# EAGLE design cpuboard (EAGLE 5.10)

## Sheet 1 of 9
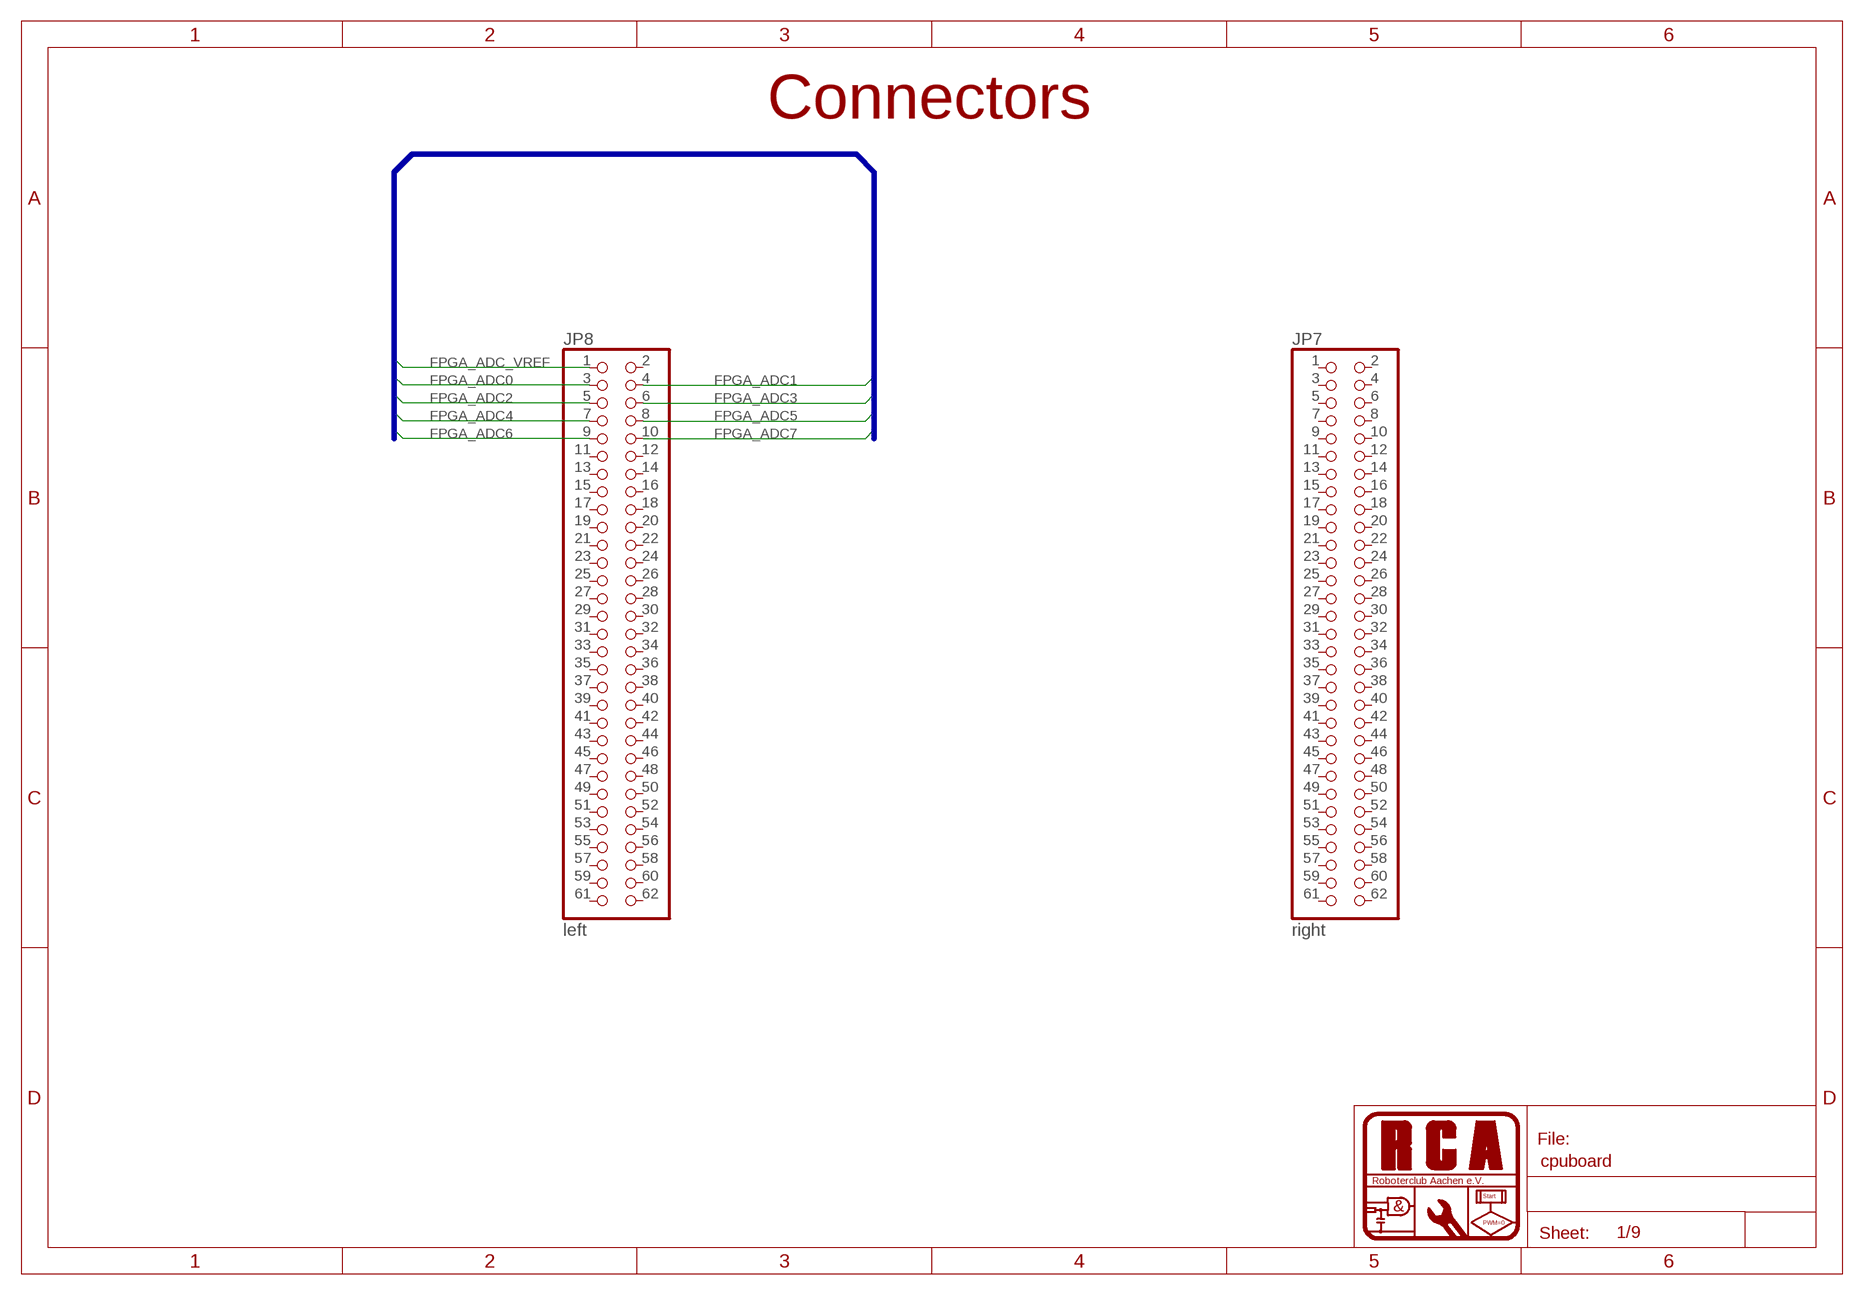
[diagram p0: schematic, sheet 1]

### Parts
JP7  right  PINHD-2X32_2.00-SMD  [2X32M_SMD]
JP8  left  PINHD-2X32_2.00-SMD  [2X32M_SMD]

### Nets
FPGA_ADC0: JP8.3 ; also sheet 4
FPGA_ADC1: JP8.4 ; also sheet 4
FPGA_ADC2: JP8.5 ; also sheet 4
FPGA_ADC3: JP8.6 ; also sheet 4
FPGA_ADC4: JP8.7 ; also sheet 4
FPGA_ADC5: JP8.8 ; also sheet 4
FPGA_ADC6: JP8.9 ; also sheet 4
FPGA_ADC7: JP8.10 ; also sheet 4
FPGA_ADC_VREF: JP8.1 ; also sheet 4
Unconnected: JP7.1 JP7.2 JP7.3 JP7.4 JP7.5 JP7.6 JP7.7 JP7.8 JP7.9 JP7.10 JP7.11 JP7.12 JP7.13 JP7.14 JP7.15 JP7.16 JP7.17 JP7.18 JP7.19 JP7.20 JP7.21 JP7.22 JP7.23 JP7.24 JP7.25 JP7.26 JP7.27 JP7.28 JP7.29 JP7.30 JP7.31 JP7.32 JP7.33 JP7.34 JP7.35 JP7.36 JP7.37 JP7.38 JP7.39 JP7.40 JP7.41 JP7.42 JP7.43 JP7.44 JP7.45 JP7.46 JP7.47 JP7.48 JP7.49 JP7.50 JP7.51 JP7.52 JP7.53 JP7.54 JP7.55 JP7.56 JP7.57 JP7.58 JP7.59 JP7.60 JP7.61 JP7.62 JP8.2 JP8.11 JP8.12 JP8.13 JP8.14 JP8.15 JP8.16 JP8.17 JP8.18 JP8.19 JP8.20 JP8.21 JP8.22 JP8.23 JP8.24 JP8.25 JP8.26 JP8.27 JP8.28 JP8.29 JP8.30 JP8.31 JP8.32 JP8.33 JP8.34 JP8.35 JP8.36 JP8.37 JP8.38 JP8.39 JP8.40 JP8.41 JP8.42 JP8.43 JP8.44 JP8.45 JP8.46 JP8.47 JP8.48 JP8.49 JP8.50 JP8.51 JP8.52 JP8.53 JP8.54 JP8.55 JP8.56 JP8.57 JP8.58 JP8.59 JP8.60 JP8.61 JP8.62

### Buses
FPGA_ADC[0..7],FPGA_ADC_VREF

### Notes on the sheet
- Connectors

## Sheet 2 of 9
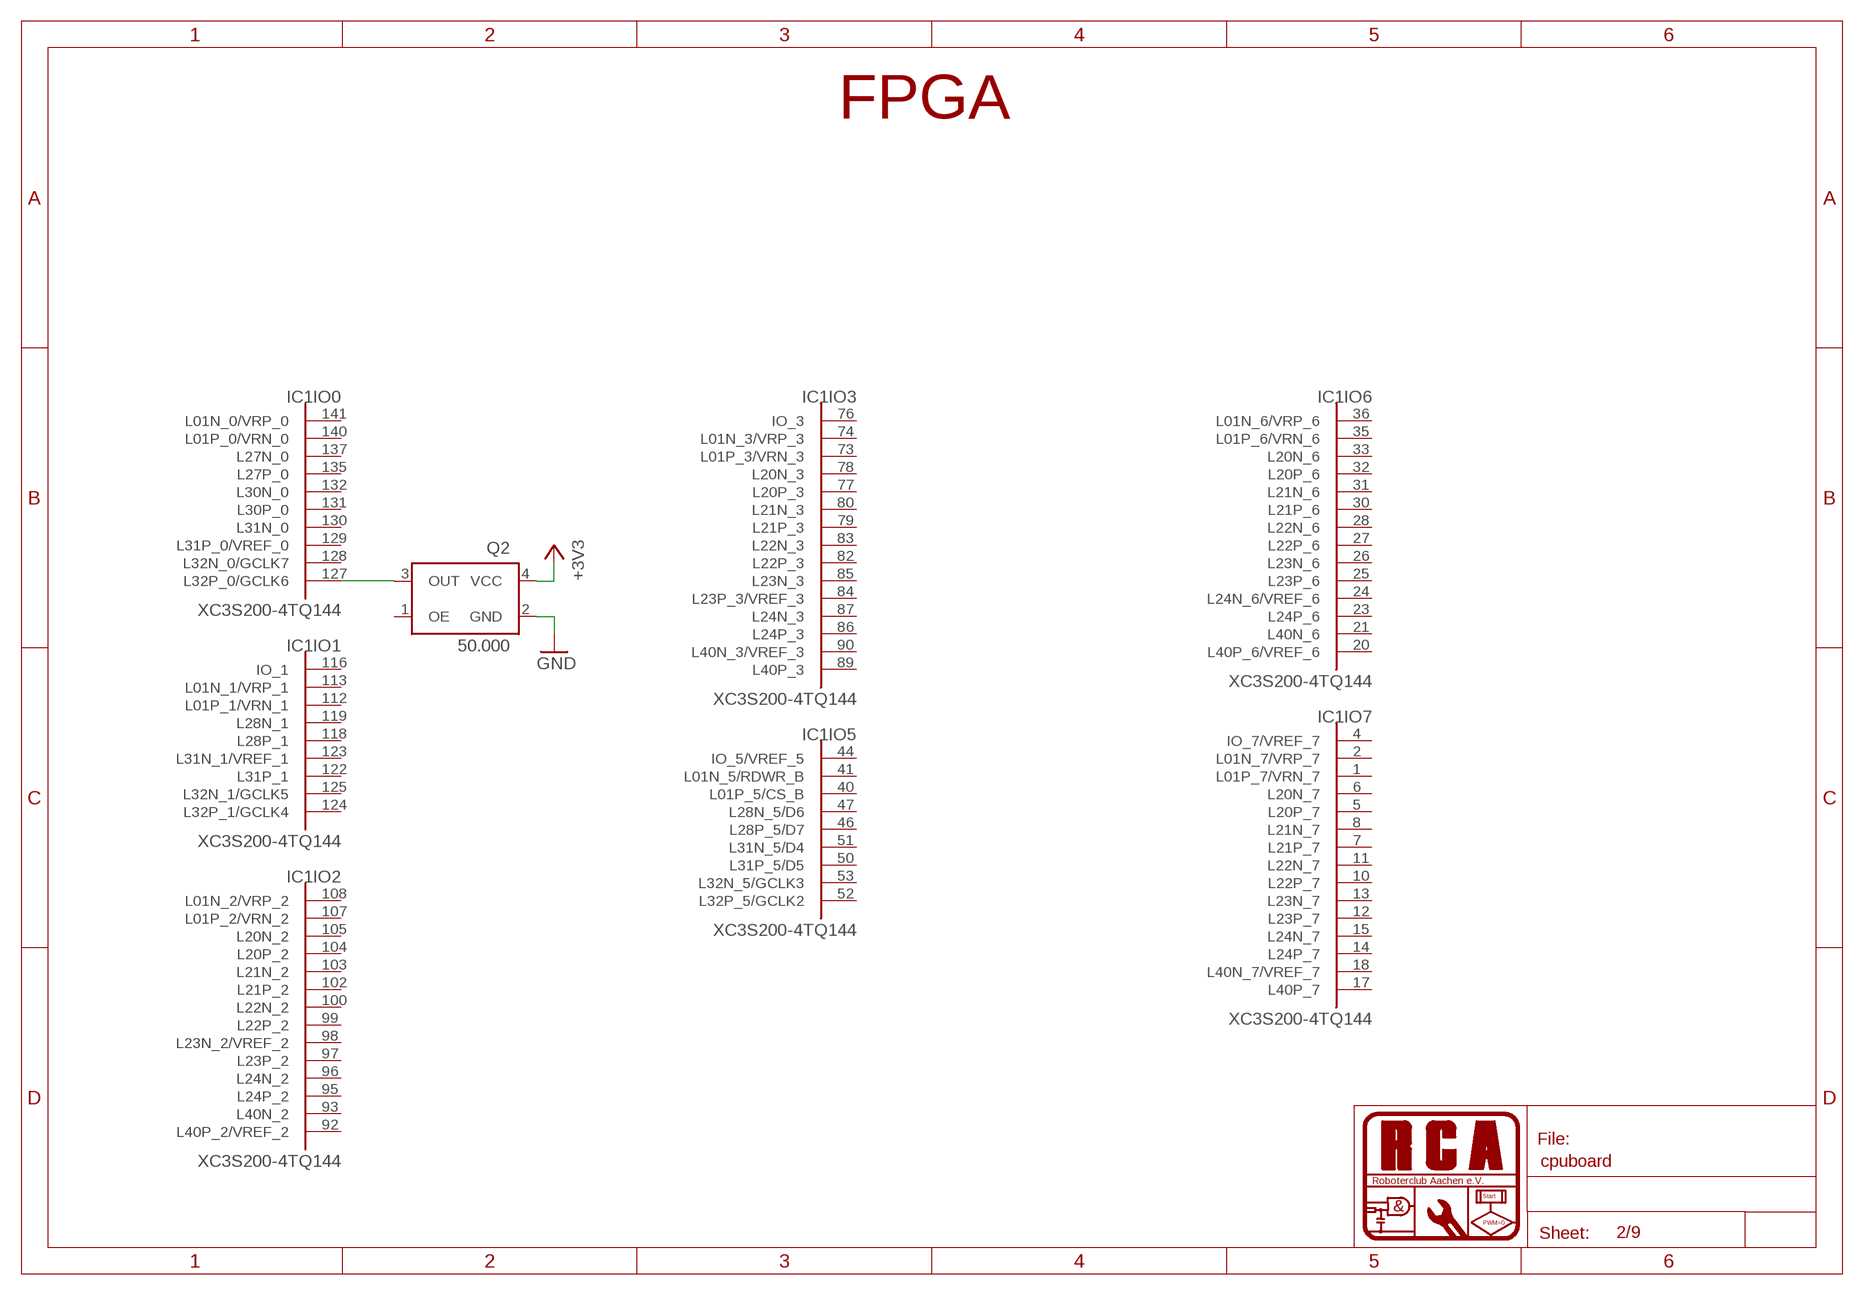
[diagram p1: schematic, sheet 2]

### Parts
IC1  XC3S200-4TQ144  [TQ144]
Q2  50.000  XO53  [XO53]

### Nets
+3V3: Q2.4(VCC) ; also sheet 4,5,6,7,8,9
GND: Q2.2(GND) ; also sheet 3,4,5,6,7,8,9
N$32: IC1.127(IO0:L32P_0/GCLK6) Q2.3(OUT)
Unconnected: IC1.1(IO7:L01P_7/VRN_7) IC1.2(IO7:L01N_7/VRP_7) IC1.4(IO7:IO_7/VREF_7) IC1.5(IO7:L20P_7) IC1.6(IO7:L20N_7) IC1.7(IO7:L21P_7) IC1.8(IO7:L21N_7) IC1.10(IO7:L22P_7) IC1.11(IO7:L22N_7) IC1.12(IO7:L23P_7) IC1.13(IO7:L23N_7) IC1.14(IO7:L24P_7) IC1.15(IO7:L24N_7) IC1.17(IO7:L40P_7) IC1.18(IO7:L40N_7/VREF_7) IC1.20(IO6:L40P_6/VREF_6) IC1.21(IO6:L40N_6) IC1.23(IO6:L24P_6) IC1.24(IO6:L24N_6/VREF_6) IC1.25(IO6:L23P_6) IC1.26(IO6:L23N_6) IC1.27(IO6:L22P_6) IC1.28(IO6:L22N_6) IC1.30(IO6:L21P_6) IC1.31(IO6:L21N_6) IC1.32(IO6:L20P_6) IC1.33(IO6:L20N_6) IC1.35(IO6:L01P_6/VRN_6) IC1.36(IO6:L01N_6/VRP_6) IC1.40(IO5:L01P_5/CS_B) IC1.41(IO5:L01N_5/RDWR_B) IC1.44(IO5:IO_5/VREF_5) IC1.46(IO5:L28P_5/D7) IC1.47(IO5:L28N_5/D6) IC1.50(IO5:L31P_5/D5) IC1.51(IO5:L31N_5/D4) IC1.52(IO5:L32P_5/GCLK2) IC1.53(IO5:L32N_5/GCLK3) IC1.73(IO3:L01P_3/VRN_3) IC1.74(IO3:L01N_3/VRP_3) IC1.76(IO3:IO_3) IC1.77(IO3:L20P_3) IC1.78(IO3:L20N_3) IC1.79(IO3:L21P_3) IC1.80(IO3:L21N_3) IC1.82(IO3:L22P_3) IC1.83(IO3:L22N_3) IC1.84(IO3:L23P_3/VREF_3) IC1.85(IO3:L23N_3) IC1.86(IO3:L24P_3) IC1.87(IO3:L24N_3) IC1.89(IO3:L40P_3) IC1.90(IO3:L40N_3/VREF_3) IC1.92(IO2:L40P_2/VREF_2) IC1.93(IO2:L40N_2) IC1.95(IO2:L24P_2) IC1.96(IO2:L24N_2) IC1.97(IO2:L23P_2) IC1.98(IO2:L23N_2/VREF_2) IC1.99(IO2:L22P_2) IC1.100(IO2:L22N_2) IC1.102(IO2:L21P_2) IC1.103(IO2:L21N_2) IC1.104(IO2:L20P_2) IC1.105(IO2:L20N_2) IC1.107(IO2:L01P_2/VRN_2) IC1.108(IO2:L01N_2/VRP_2) IC1.112(IO1:L01P_1/VRN_1) IC1.113(IO1:L01N_1/VRP_1) IC1.116(IO1:IO_1) IC1.118(IO1:L28P_1) IC1.119(IO1:L28N_1) IC1.122(IO1:L31P_1) IC1.123(IO1:L31N_1/VREF_1) IC1.124(IO1:L32P_1/GCLK4) IC1.125(IO1:L32N_1/GCLK5) IC1.128(IO0:L32N_0/GCLK7) IC1.129(IO0:L31P_0/VREF_0) IC1.130(IO0:L31N_0) IC1.131(IO0:L30P_0) IC1.132(IO0:L30N_0) IC1.135(IO0:L27P_0) IC1.137(IO0:L27N_0) IC1.140(IO0:L01P_0/VRN_0) IC1.141(IO0:L01N_0/VRP_0) Q2.1(OE)

### Notes on the sheet
- FPGA

## Sheet 3 of 9
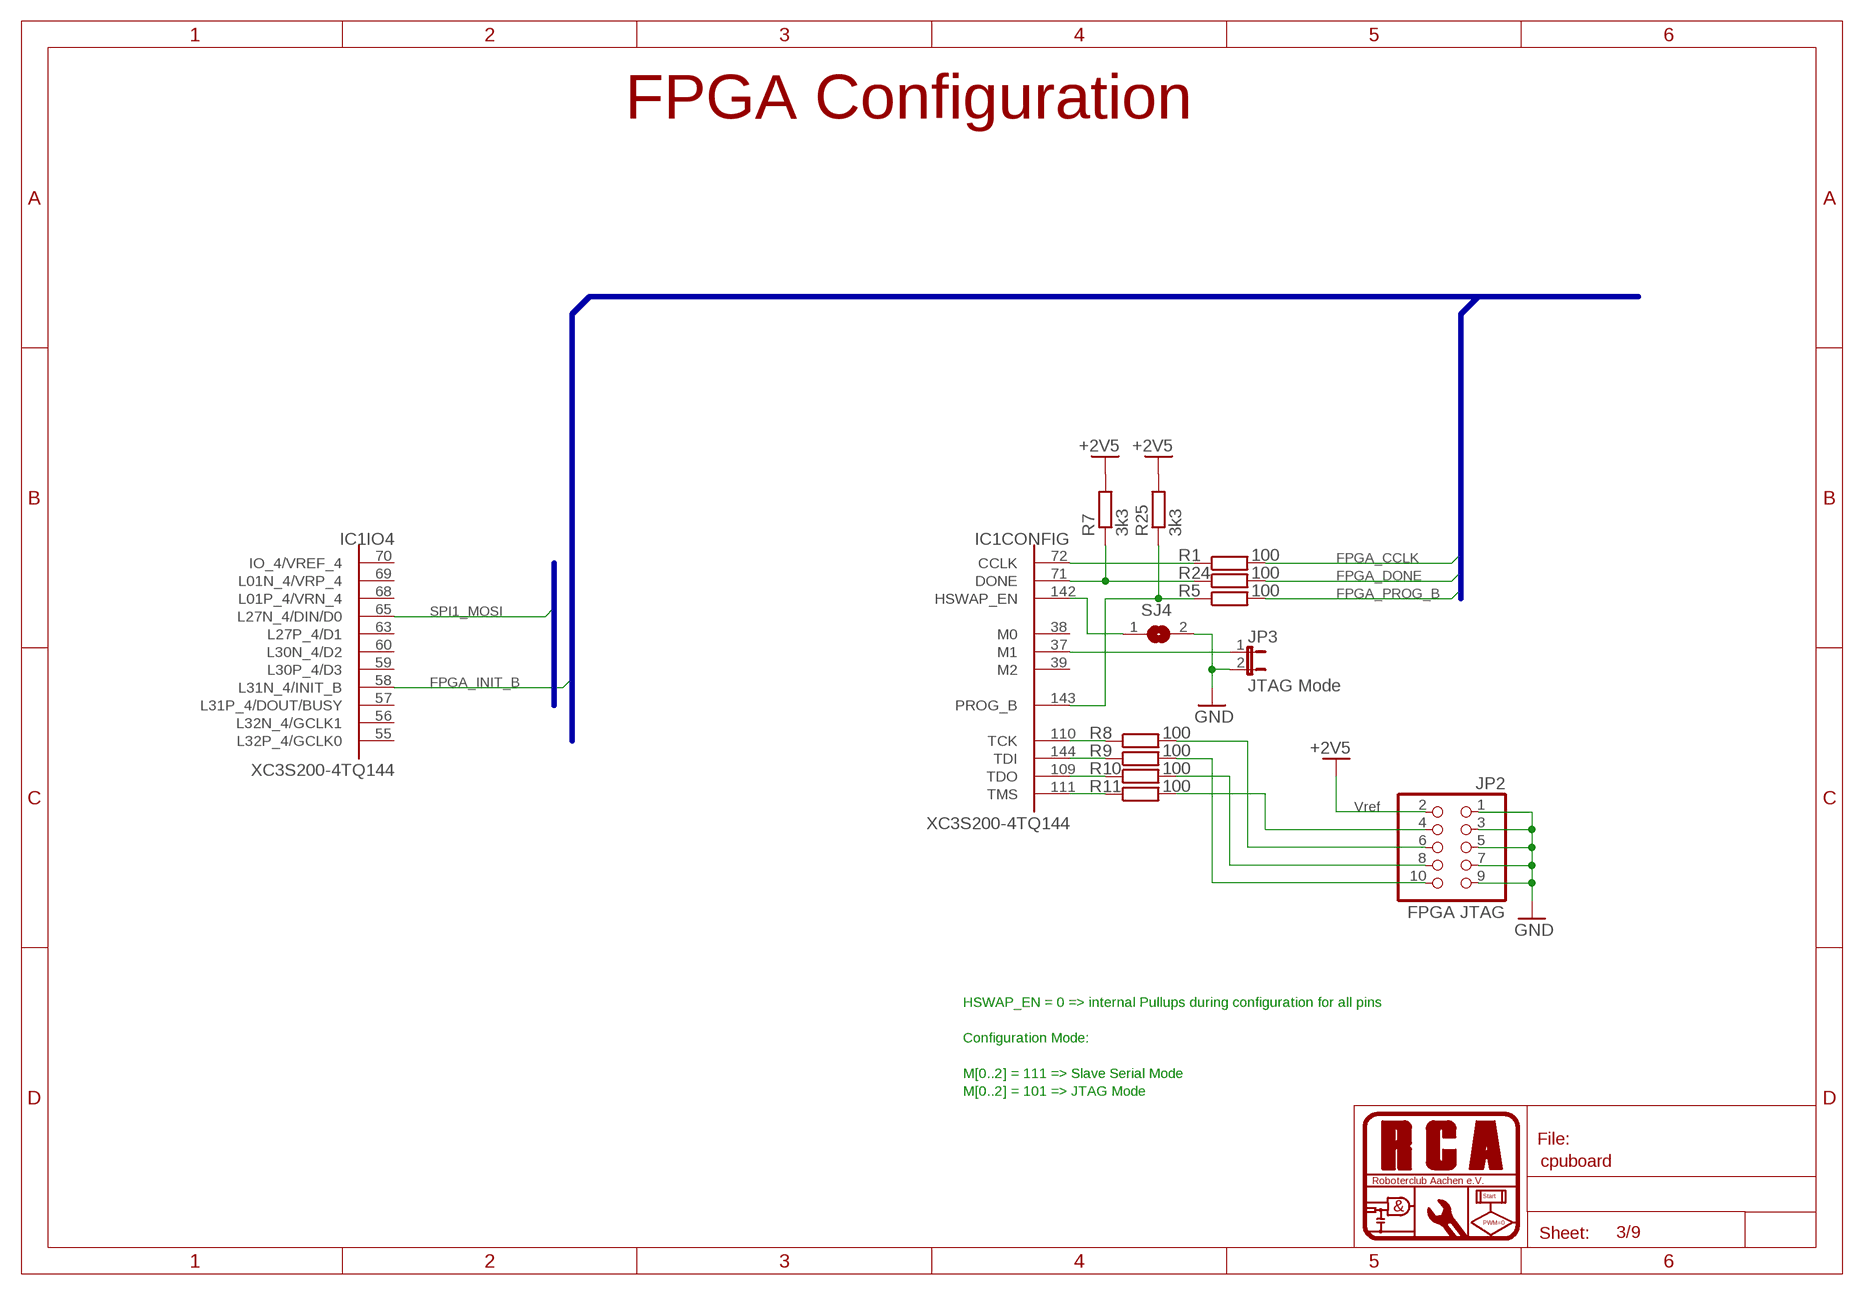
[diagram p2: schematic, sheet 3]

### Parts
JP2  FPGA JTAG  PINHD-2X5_2.54-SMD  [2X05SMD]
JP3  JTAG Mode  JP1E  [JP1]
R1  100  R-EU_R0805  [R0805]
R5  100  R-EU_R0805  [R0805]
R7  3k3  R-EU_R0805  [R0805]
R8  100  R-EU_R0805  [R0805]
R9  100  R-EU_R0805  [R0805]
R10  100  R-EU_R0805  [R0805]
R11  100  R-EU_R0805  [R0805]
R24  100  R-EU_R0805  [R0805]
R25  3k3  R-EU_R0805  [R0805]
SJ4  SJ  [SJ]

### Nets
+2V5: JP2.2 R7.2 R25.2 ; also sheet 5,9
FPGA_CCLK: R1.2
FPGA_DONE: R24.2
FPGA_INIT_B: IC1.58(IO4:L31N_4/INIT_B)
FPGA_PROG_B: R5.2
GND: JP2.1 JP2.3 JP2.5 JP2.7 JP2.9 JP3.2 SJ4.2 ; also sheet 2,4,5,6,7,8,9
N$2: IC1.143(CONFIG:PROG_B) R5.1 R25.1
N$3: IC1.71(CONFIG:DONE) R7.1 R24.1
N$5: IC1.37(CONFIG:M1) JP3.1
N$6: IC1.142(CONFIG:HSWAP_EN) SJ4.1
N$7: IC1.72(CONFIG:CCLK) R1.1
N$8: IC1.110(CONFIG:TCK) R8.1
N$9: IC1.144(CONFIG:TDI) R9.1
N$10: IC1.109(CONFIG:TDO) R10.1
N$11: IC1.111(CONFIG:TMS) R11.1
N$12: JP2.6 R8.2
N$13: JP2.8 R10.2
N$14: JP2.10 R9.2
N$15: JP2.4 R11.2
SPI1_MOSI: IC1.65(IO4:L27N_4/DIN/D0) ; also sheet 6
Unconnected: IC1.38(CONFIG:M0) IC1.39(CONFIG:M2) IC1.55(IO4:L32P_4/GCLK0) IC1.56(IO4:L32N_4/GCLK1) IC1.57(IO4:L31P_4/DOUT/BUSY) IC1.59(IO4:L30P_4/D3) IC1.60(IO4:L30N_4/D2) IC1.63(IO4:L27P_4/D1) IC1.68(IO4:L01P_4/VRN_4) IC1.69(IO4:L01N_4/VRP_4) IC1.70(IO4:IO_4/VREF_4)

### Buses
SPI1_NSS,SPI1_SCK,SPI1_MISO,SPI1_MOSI
FPGA_CCLK,FPGA_INIT_B,FPGA_DONE,FPGA_PROG_B

### Notes on the sheet
- FPGA Configuration
- Vref
- HSWAP_EN = 0 => internal Pullups during configuration for all pins
- Configuration Mode:
- M[0..2] = 111 => Slave Serial Mode
- M[0..2] = 101 => JTAG Mode

## Sheet 4 of 9
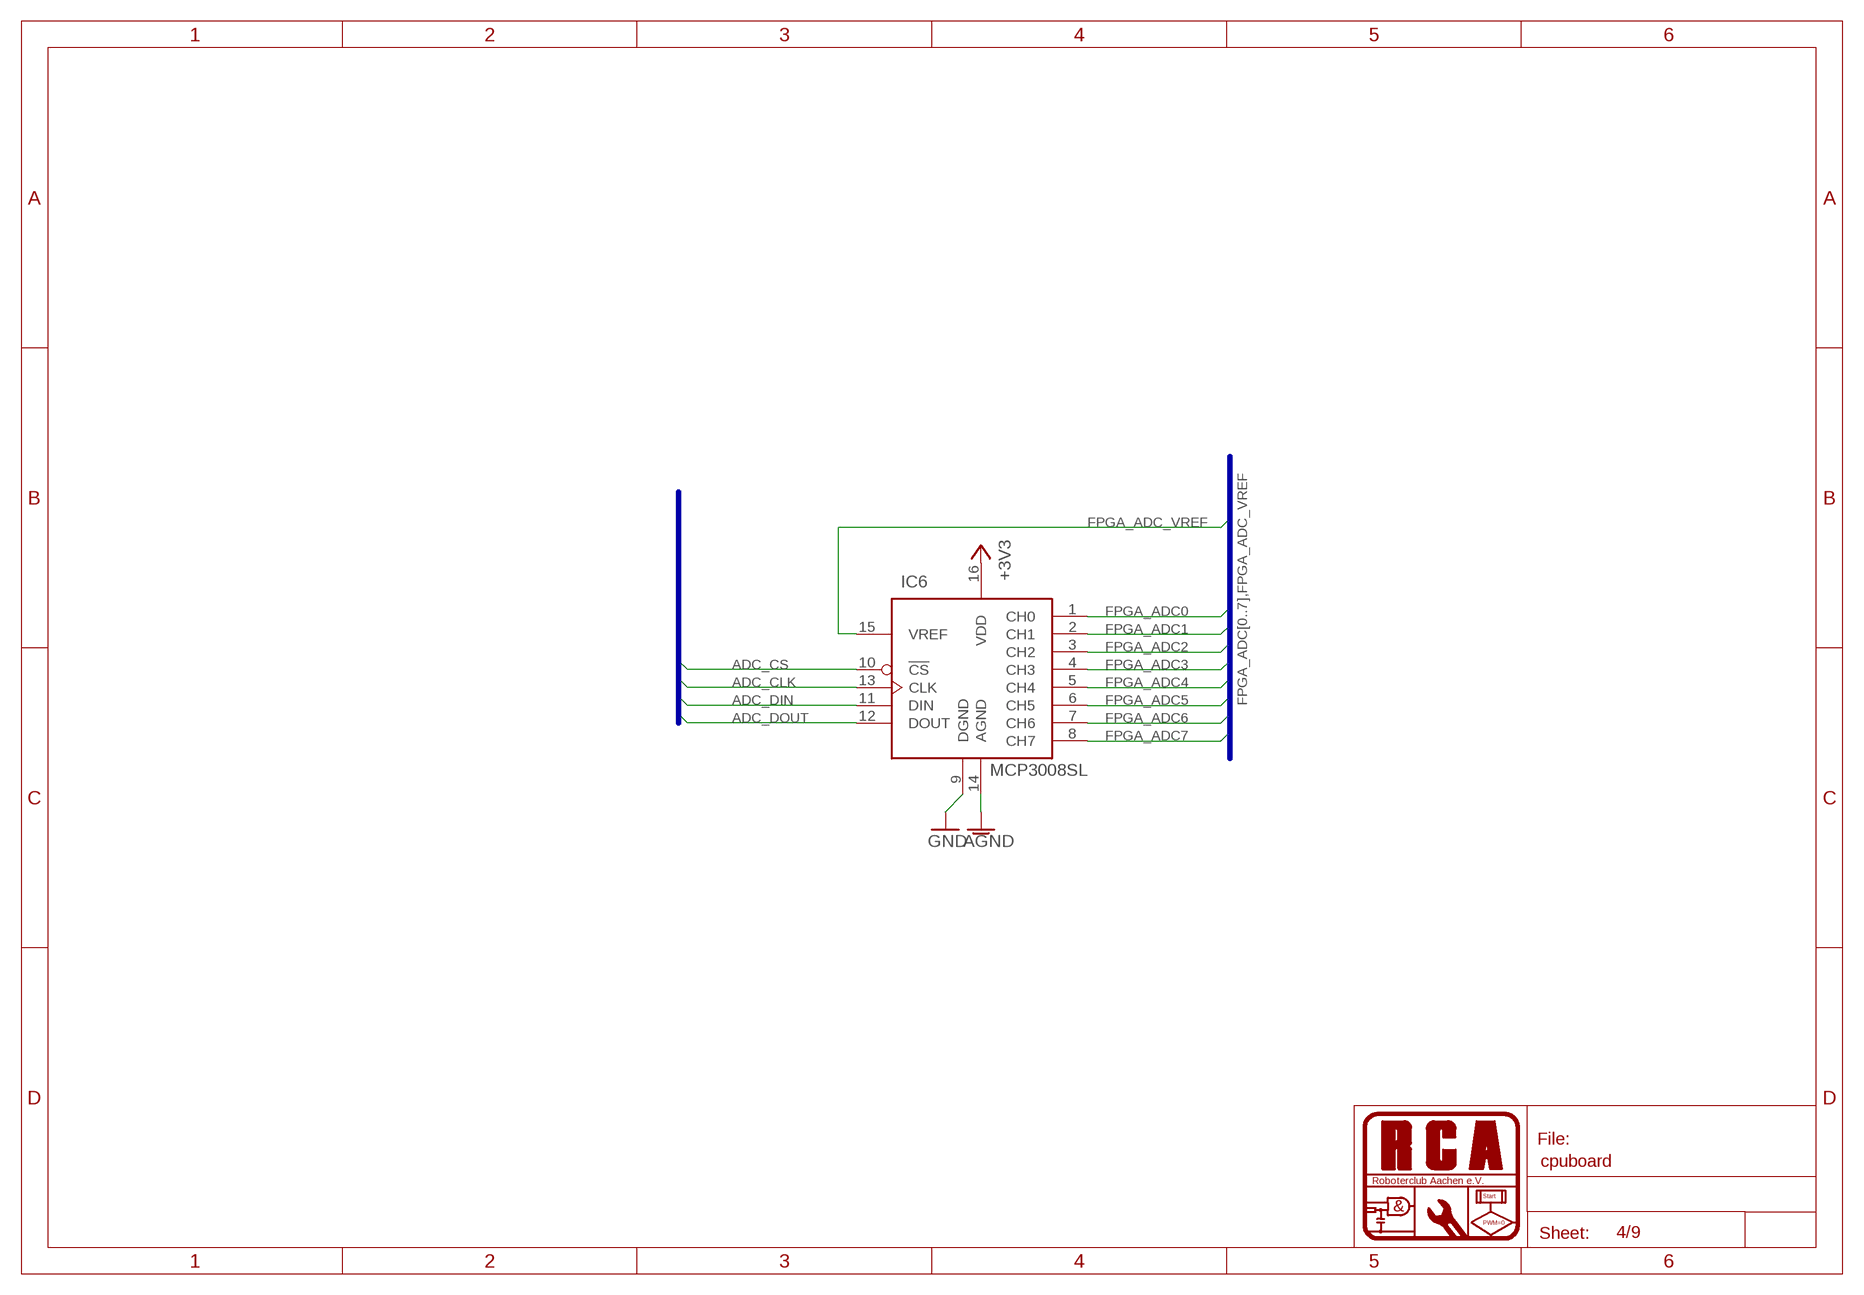
[diagram p3: schematic, sheet 4]

### Parts
IC6  MCP3008SL  [SO16]

### Nets
+3V3: IC6.16(VDD) ; also sheet 2,5,6,7,8,9
ADC_CLK: IC6.13(CLK)
ADC_CS: IC6.10(!CS)
ADC_DIN: IC6.11(DIN)
ADC_DOUT: IC6.12(DOUT)
AGND: IC6.14(AGND)
FPGA_ADC0: IC6.1(CH0) ; also sheet 1
FPGA_ADC1: IC6.2(CH1) ; also sheet 1
FPGA_ADC2: IC6.3(CH2) ; also sheet 1
FPGA_ADC3: IC6.4(CH3) ; also sheet 1
FPGA_ADC4: IC6.5(CH4) ; also sheet 1
FPGA_ADC5: IC6.6(CH5) ; also sheet 1
FPGA_ADC6: IC6.7(CH6) ; also sheet 1
FPGA_ADC7: IC6.8(CH7) ; also sheet 1
FPGA_ADC_VREF: IC6.15(VREF) ; also sheet 1
GND: IC6.9(DGND) ; also sheet 2,3,5,6,7,8,9

### Buses
FPGA_ADC[0..7],FPGA_ADC_VREF
ADC_CS,ADC_CLK,ADC_DIN,ADC_DOUT

## Sheet 5 of 9
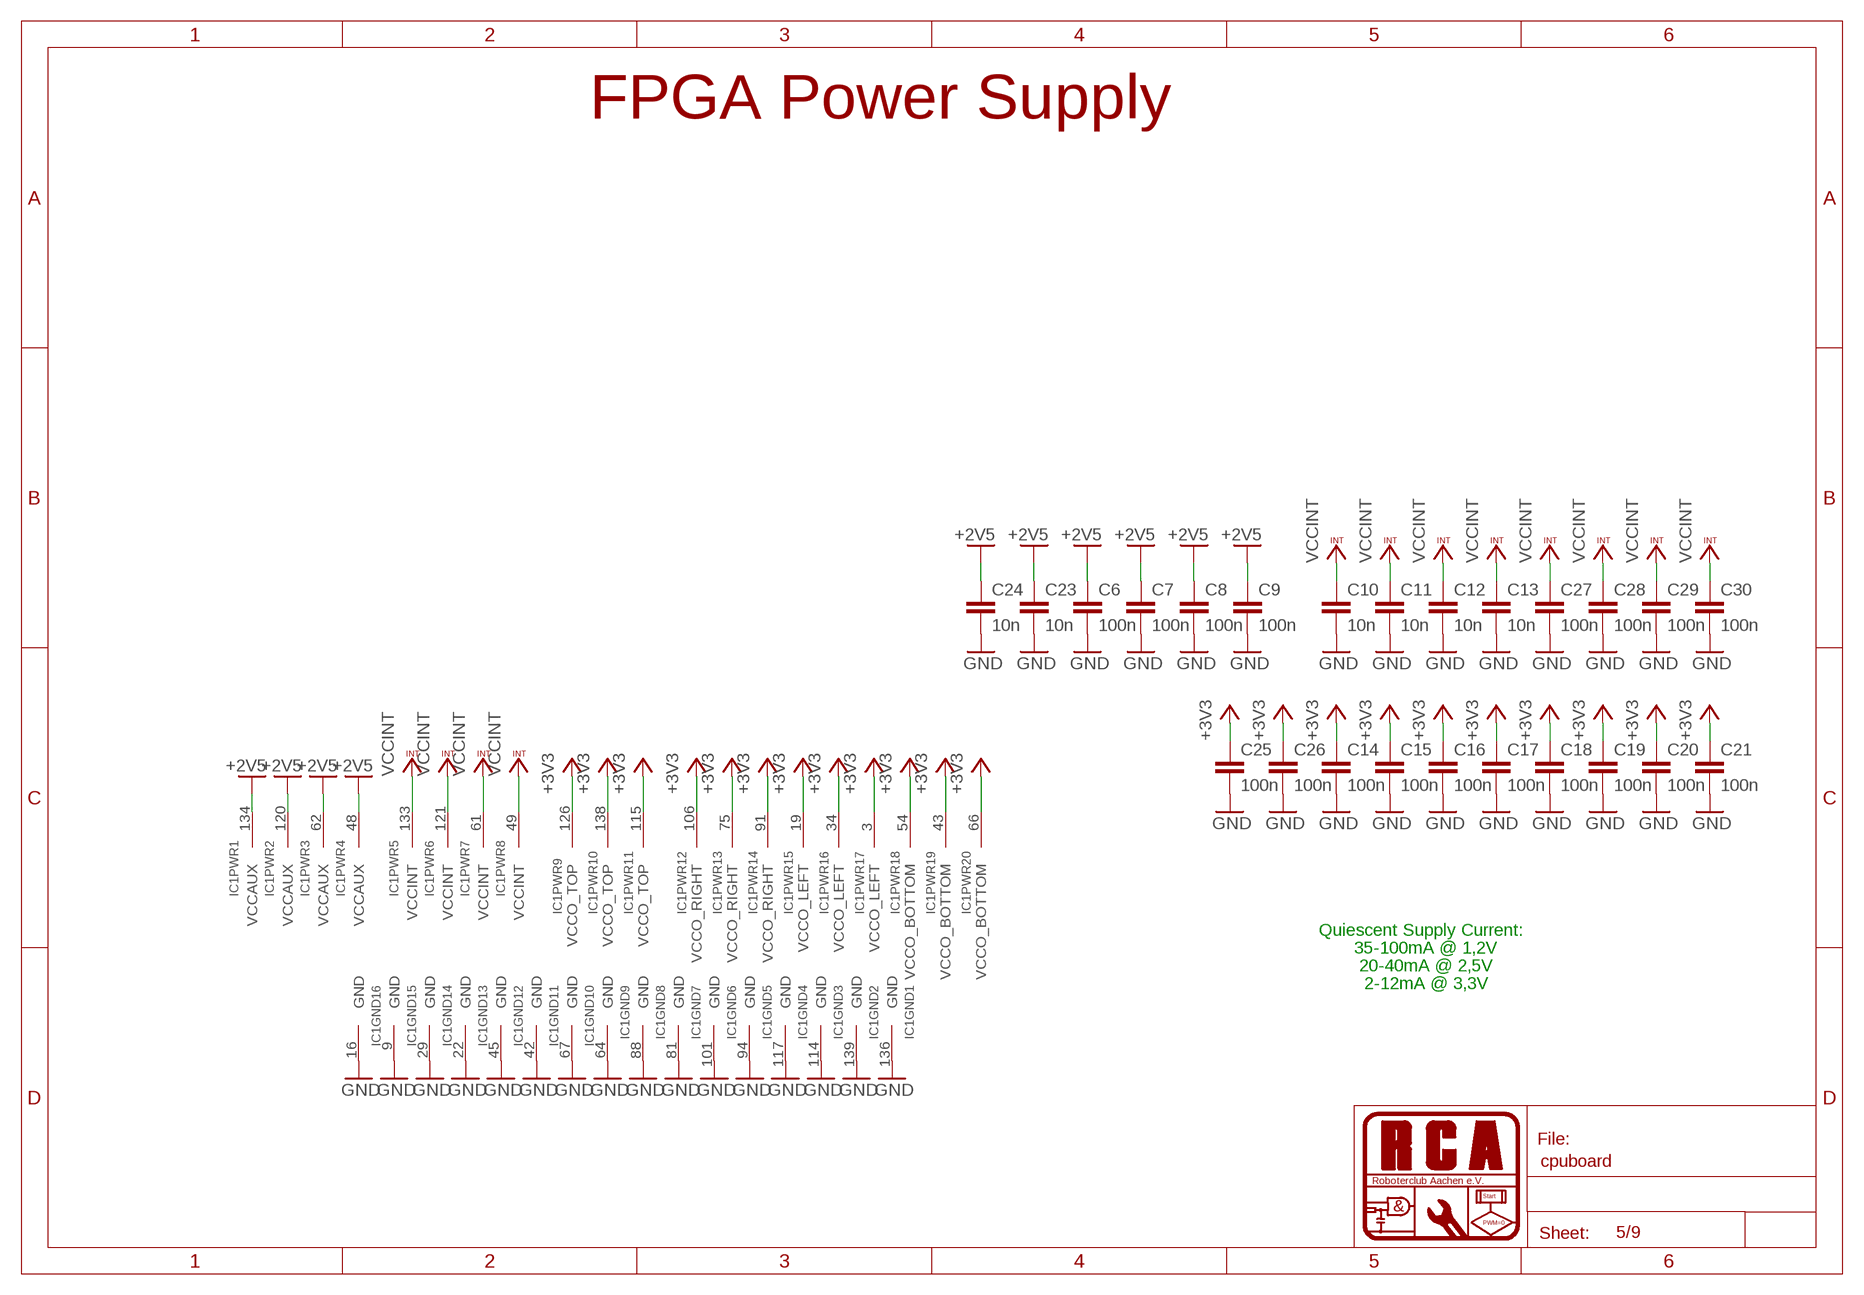
[diagram p4: schematic, sheet 5]

### Parts
C6  100n  C-EUC0603  [C0603]
C7  100n  C-EUC0603  [C0603]
C8  100n  C-EUC0603  [C0603]
C9  100n  C-EUC0603  [C0603]
C10  10n  C-EUC0603  [C0603]
C11  10n  C-EUC0603  [C0603]
C12  10n  C-EUC0603  [C0603]
C13  10n  C-EUC0603  [C0603]
C14  100n  C-EUC0603  [C0603]
C15  100n  C-EUC0603  [C0603]
C16  100n  C-EUC0603  [C0603]
C17  100n  C-EUC0603  [C0603]
C18  100n  C-EUC0603  [C0603]
C19  100n  C-EUC0603  [C0603]
C20  100n  C-EUC0603  [C0603]
C21  100n  C-EUC0603  [C0603]
C23  10n  C-EUC0603  [C0603]
C24  10n  C-EUC0603  [C0603]
C25  100n  C-EUC0603  [C0603]
C26  100n  C-EUC0603  [C0603]
C27  100n  C-EUC0603  [C0603]
C28  100n  C-EUC0603  [C0603]
C29  100n  C-EUC0603  [C0603]
C30  100n  C-EUC0603  [C0603]

### Nets
+2V5: C6.1 C7.1 C8.1 C9.1 C23.1 C24.1 IC1.48(PWR4:VCCAUX) IC1.62(PWR3:VCCAUX) IC1.120(PWR2:VCCAUX) IC1.134(PWR1:VCCAUX) ; also sheet 3,9
+3V3: C14.1 C15.1 C16.1 C17.1 C18.1 C19.1 C20.1 C21.1 C25.1 C26.1 IC1.3(PWR17:VCCO_LEFT) IC1.19(PWR15:VCCO_LEFT) IC1.34(PWR16:VCCO_LEFT) IC1.43(PWR19:VCCO_BOTTOM) IC1.54(PWR18:VCCO_BOTTOM) IC1.66(PWR20:VCCO_BOTTOM) IC1.75(PWR13:VCCO_RIGHT) IC1.91(PWR14:VCCO_RIGHT) IC1.106(PWR12:VCCO_RIGHT) IC1.115(PWR11:VCCO_TOP) IC1.126(PWR9:VCCO_TOP) IC1.138(PWR10:VCCO_TOP) ; also sheet 2,4,6,7,8,9
GND: C6.2 C7.2 C8.2 C9.2 C10.2 C11.2 C12.2 C13.2 C14.2 C15.2 C16.2 C17.2 C18.2 C19.2 C20.2 C21.2 C23.2 C24.2 C25.2 C26.2 C27.2 C28.2 C29.2 C30.2 IC1.9(GND15:GND) IC1.16(GND16:GND) IC1.22(GND13:GND) IC1.29(GND14:GND) IC1.42(GND11:GND) IC1.45(GND12:GND) IC1.64(GND9:GND) IC1.67(GND10:GND) IC1.81(GND7:GND) IC1.88(GND8:GND) IC1.94(GND5:GND) IC1.101(GND6:GND) IC1.114(GND3:GND) IC1.117(GND4:GND) IC1.136(GND1:GND) IC1.139(GND2:GND) ; also sheet 2,3,4,6,7,8,9
VCCINT: C10.1 C11.1 C12.1 C13.1 C27.1 C28.1 C29.1 C30.1 IC1.49(PWR8:VCCINT) IC1.61(PWR7:VCCINT) IC1.121(PWR6:VCCINT) IC1.133(PWR5:VCCINT) ; also sheet 9

### Notes on the sheet
- FPGA Power Supply
- Quiescent Supply Current:
- 35-100mA @ 1,2V
- 20-40mA @ 2,5V
- 2-12mA @ 3,3V

## Sheet 6 of 9
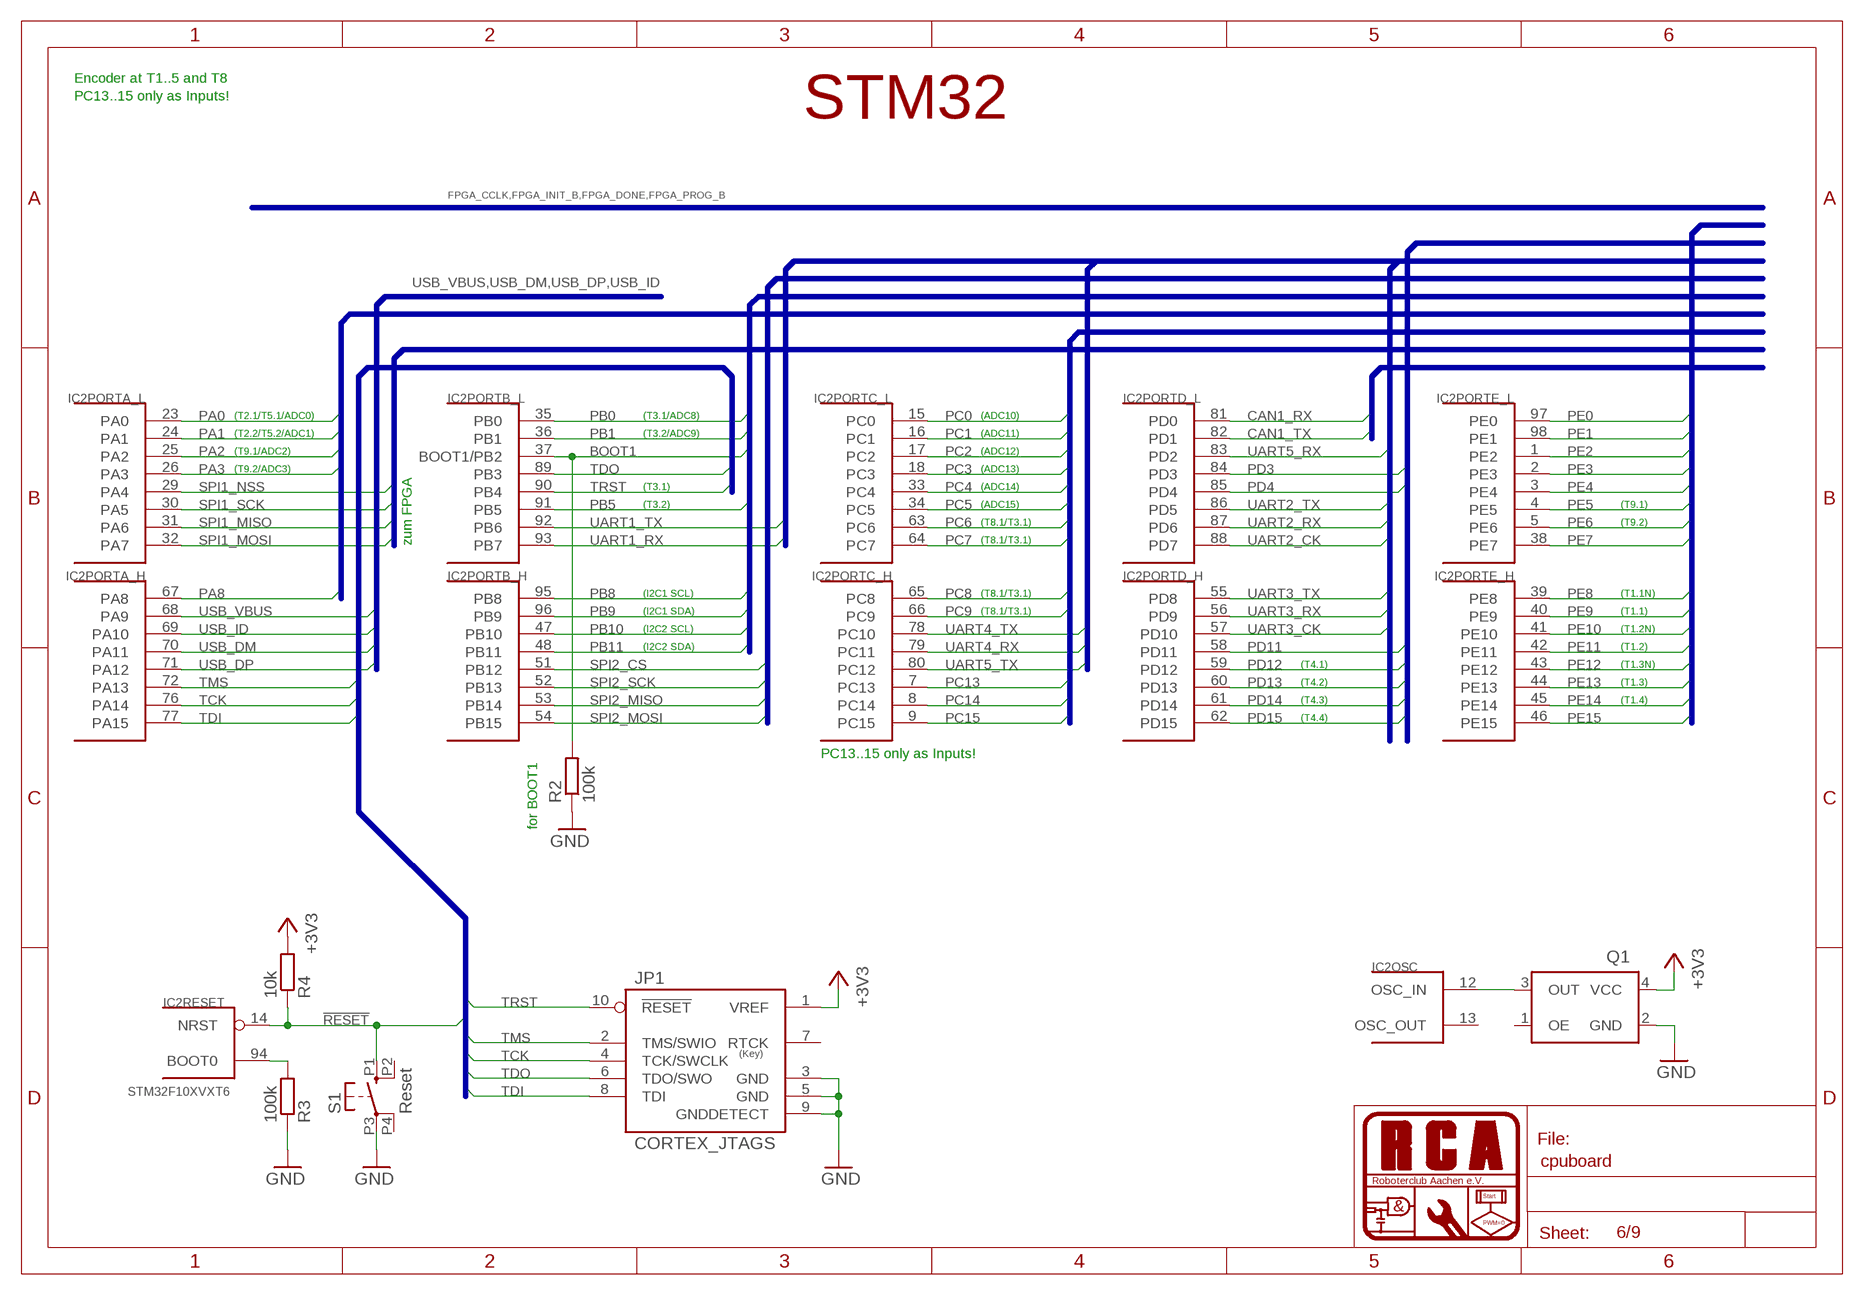
[diagram p5: schematic, sheet 6]

### Parts
IC2  STM32F10XVXT6  [TQFP100]
JP1  CORTEX_JTAGS  [2X05SMD]
Q1  XO53  [XO53]
R2  100k  R-EU_R0805  [R0805]
R3  100k  R-EU_R0805  [R0805]
R4  10k  R-EU_R0805  [R0805]
S1  Reset  10-XXLSH  [B3F-10XX-SMD]

### Nets
!RESET: IC2.14(RESET:NRST) R4.1 S1.P1(S)
+3V3: JP1.1(VREF) Q1.4(VCC) R4.2 ; also sheet 2,4,5,7,8,9
BOOT1: IC2.37(PORTB_L:BOOT1/PB2) R2.2
CAN1_RX: IC2.81(PORTD_L:PD0) ; also sheet 7
CAN1_TX: IC2.82(PORTD_L:PD1) ; also sheet 7
GND: JP1.3(GND) JP1.5(GND) JP1.9(GNDDETECT) Q1.2(GND) R2.1 R3.1 S1.P3(P) ; also sheet 2,3,4,5,7,8,9
N$1: IC2.12(OSC:OSC_IN) Q1.3(OUT)
N$4: IC2.94(RESET:BOOT0) R3.2
PA0: IC2.23(PORTA_L:PA0)
PA1: IC2.24(PORTA_L:PA1)
PA2: IC2.25(PORTA_L:PA2)
PA3: IC2.26(PORTA_L:PA3)
PA8: IC2.67(PORTA_H:PA8)
PB0: IC2.35(PORTB_L:PB0)
PB1: IC2.36(PORTB_L:PB1)
PB5: IC2.91(PORTB_L:PB5)
PB8: IC2.95(PORTB_H:PB8)
PB9: IC2.96(PORTB_H:PB9)
PB10: IC2.47(PORTB_H:PB10)
PB11: IC2.48(PORTB_H:PB11)
PC0: IC2.15(PORTC_L:PC0)
PC1: IC2.16(PORTC_L:PC1)
PC2: IC2.17(PORTC_L:PC2)
PC3: IC2.18(PORTC_L:PC3)
PC4: IC2.33(PORTC_L:PC4)
PC5: IC2.34(PORTC_L:PC5)
PC6: IC2.63(PORTC_L:PC6)
PC7: IC2.64(PORTC_L:PC7)
PC8: IC2.65(PORTC_H:PC8)
PC9: IC2.66(PORTC_H:PC9)
PC13: IC2.7(PORTC_H:PC13)
PC14: IC2.8(PORTC_H:PC14)
PC15: IC2.9(PORTC_H:PC15)
PD3: IC2.84(PORTD_L:PD3)
PD4: IC2.85(PORTD_L:PD4)
PD11: IC2.58(PORTD_H:PD11)
PD12: IC2.59(PORTD_H:PD12)
PD13: IC2.60(PORTD_H:PD13)
PD14: IC2.61(PORTD_H:PD14)
PD15: IC2.62(PORTD_H:PD15)
PE0: IC2.97(PORTE_L:PE0)
PE1: IC2.98(PORTE_L:PE1)
PE2: IC2.1(PORTE_L:PE2)
PE3: IC2.2(PORTE_L:PE3)
PE4: IC2.3(PORTE_L:PE4)
PE5: IC2.4(PORTE_L:PE5)
PE6: IC2.5(PORTE_L:PE6)
PE7: IC2.38(PORTE_L:PE7)
PE8: IC2.39(PORTE_H:PE8)
PE9: IC2.40(PORTE_H:PE9)
PE10: IC2.41(PORTE_H:PE10)
PE11: IC2.42(PORTE_H:PE11)
PE12: IC2.43(PORTE_H:PE12)
PE13: IC2.44(PORTE_H:PE13)
PE14: IC2.45(PORTE_H:PE14)
PE15: IC2.46(PORTE_H:PE15)
SPI1_MISO: IC2.31(PORTA_L:PA6)
SPI1_MOSI: IC2.32(PORTA_L:PA7) ; also sheet 3
SPI1_NSS: IC2.29(PORTA_L:PA4)
SPI1_SCK: IC2.30(PORTA_L:PA5)
SPI2_CS: IC2.51(PORTB_H:PB12)
SPI2_MISO: IC2.53(PORTB_H:PB14)
SPI2_MOSI: IC2.54(PORTB_H:PB15)
SPI2_SCK: IC2.52(PORTB_H:PB13)
TCK: IC2.76(PORTA_H:PA14) JP1.4(TCK/SWCLK)
TDI: IC2.77(PORTA_H:PA15) JP1.8(TDI)
TDO: IC2.89(PORTB_L:PB3) JP1.6(TDO/SWO)
TMS: IC2.72(PORTA_H:PA13) JP1.2(TMS/SWIO)
TRST: IC2.90(PORTB_L:PB4) JP1.10(!RESET)
UART1_RX: IC2.93(PORTB_L:PB7)
UART1_TX: IC2.92(PORTB_L:PB6)
UART2_CK: IC2.88(PORTD_L:PD7)
UART2_RX: IC2.87(PORTD_L:PD6)
UART2_TX: IC2.86(PORTD_L:PD5)
UART3_CK: IC2.57(PORTD_H:PD10)
UART3_RX: IC2.56(PORTD_H:PD9)
UART3_TX: IC2.55(PORTD_H:PD8)
UART4_RX: IC2.79(PORTC_H:PC11)
UART4_TX: IC2.78(PORTC_H:PC10)
UART5_RX: IC2.83(PORTD_L:PD2)
UART5_TX: IC2.80(PORTC_H:PC12)
USB_DM: IC2.70(PORTA_H:PA11) ; also sheet 7
USB_DP: IC2.71(PORTA_H:PA12) ; also sheet 7
USB_ID: IC2.69(PORTA_H:PA10) ; also sheet 7
USB_VBUS: IC2.68(PORTA_H:PA9) ; also sheet 7
Unconnected: IC2.13(OSC:OSC_OUT) JP1.7(RTCK) Q1.1(OE) S1.P2(S1) S1.P4(P1)

### Buses
!RESET,TRST,TMS,TCK,TDO,TDI
USB_VBUS,USB_DM,USB_DP,USB_ID
SPI1_NSS,SPI1_SCK,SPI1_MISO,SPI1_MOSI
CAN1_RX,CAN1_TX
PA[0..3],PA8
PB[0..1],BOOT1,PB5,PB[8..11]
SPI2_CS,SPI2_SCK,SPI2_MISO,SPI2_MOSI
PC[0..9],PC[13..15]
UART1_TX,UART1_RX,UART2_TX,UART2_RX,UART2_CK,UART3_TX,UART3_RX,UART3_CK,UART4_TX,UART4_RX,UART5_TX,UART5_RX
PD[3..4],PD[11..15]
PE[0..15]
FPGA_CCLK,FPGA_INIT_B,FPGA_DONE,FPGA_PROG_B

### Notes on the sheet
- Encoder at T1..5 and T8
- PC13..15 only as Inputs!
- STM32
- (T2.1/T5.1/ADC0) | (T3.1/ADC8) | (ADC10)
- (T2.2/T5.2/ADC1) | (T3.2/ADC9) | (ADC11)
- (T9.1/ADC2) | (ADC12)
- (T9.2/ADC3) | (ADC13)
- (T3.1) | (ADC14)
- (T3.2) | (ADC15) | (T9.1)
- (T8.1/T3.1) | (T9.2)
- zum FPGA | (T8.1/T3.1)
- (I2C1 SCL) | (T8.1/T3.1) | (T1.1N)
- (I2C1 SDA) | (T8.1/T3.1) | (T1.1)
- (I2C2 SCL) | (T1.2N)
- (I2C2 SDA) | (T1.2)
- (T4.1) | (T1.3N)
- (T4.2) | (T1.3)
- (T4.3) | (T1.4)
- (T4.4)
- PC13..15 only as Inputs!
- for BOOT1

## Sheet 7 of 9
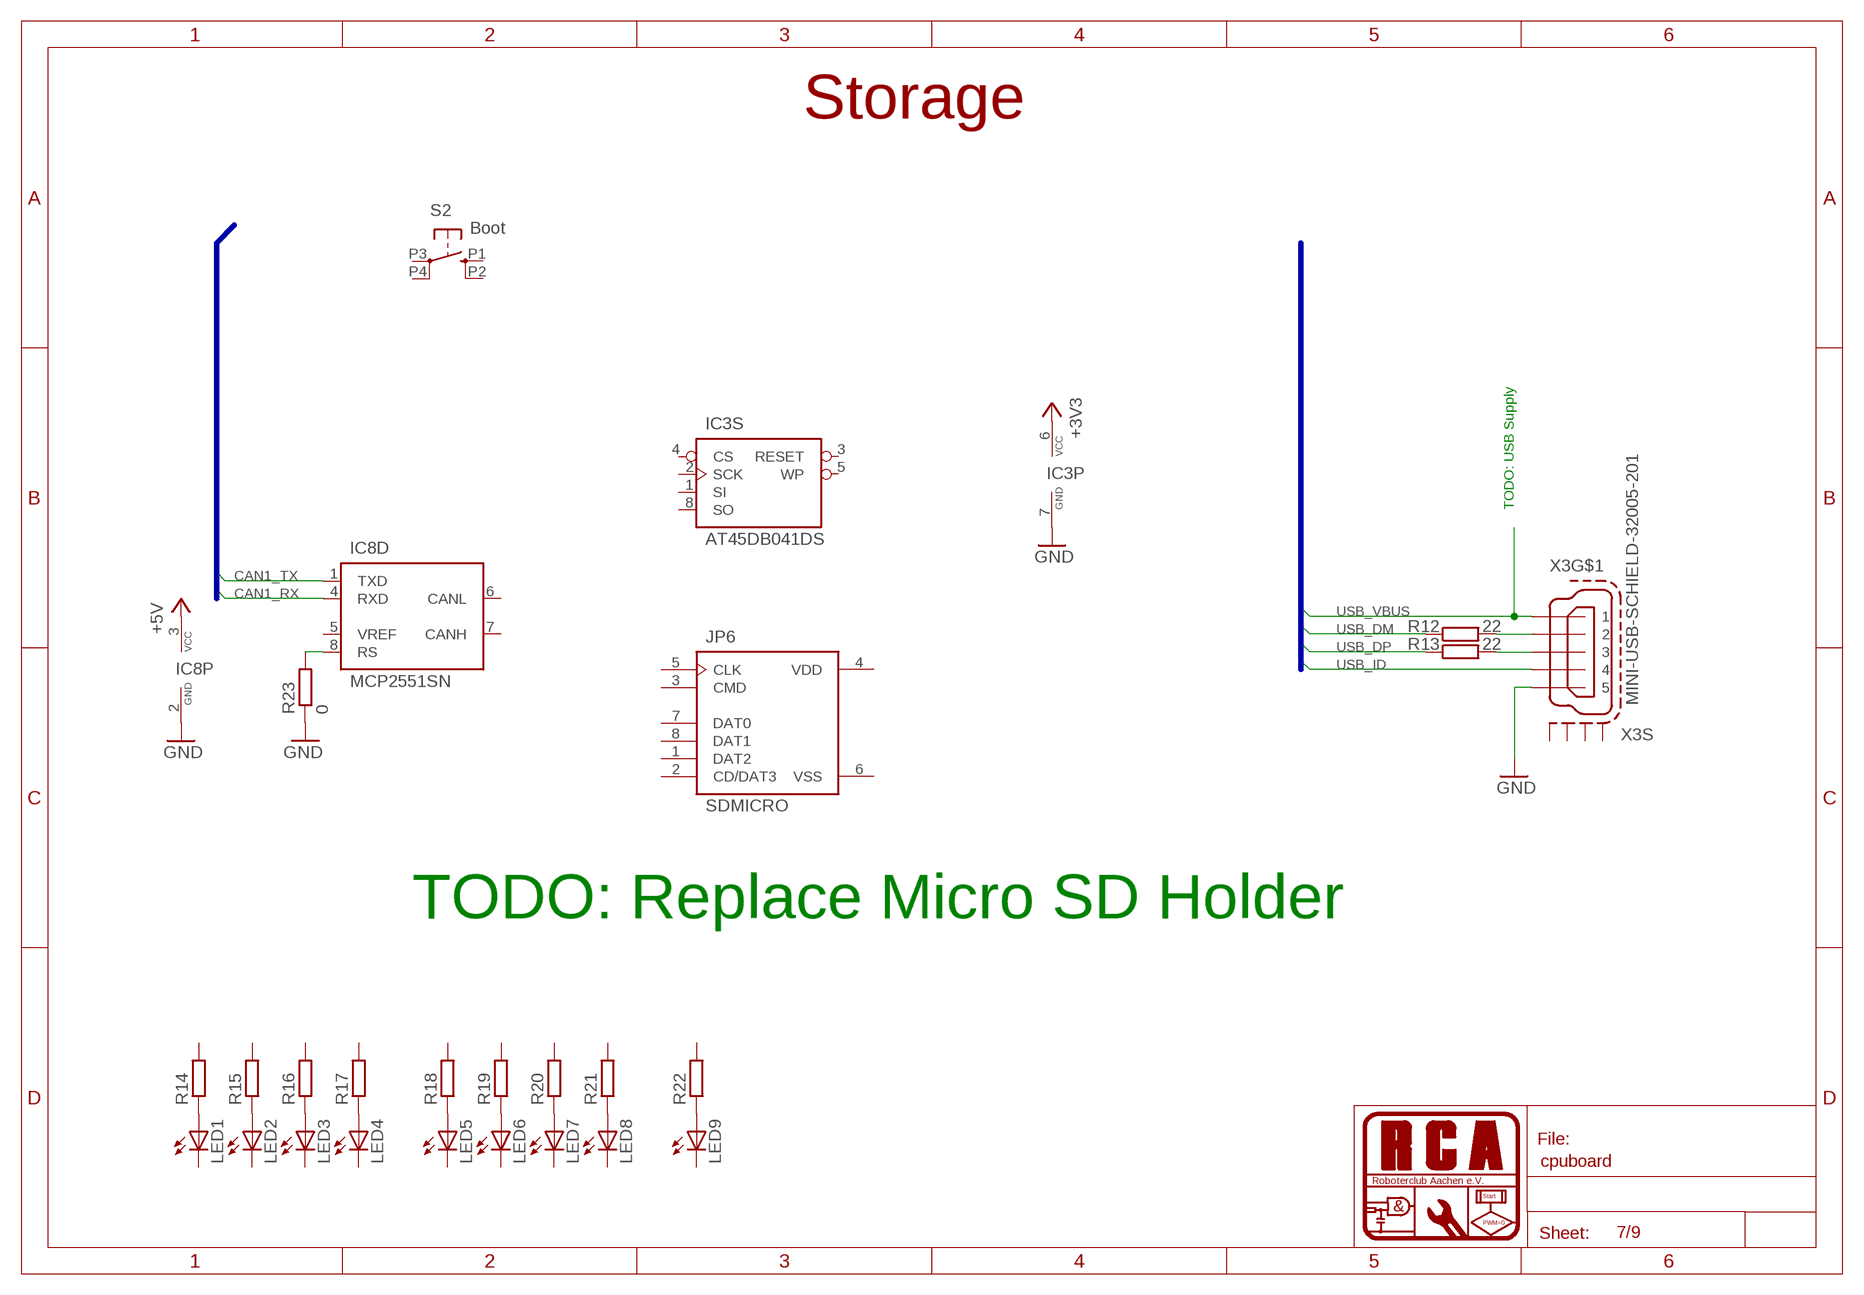
[diagram p6: schematic, sheet 7]

### Parts
IC3  AT45DB041DS  [SO-08M]
IC8  MCP2551SN  [SOIC-8]
JP6  SDMICRO  [MICRO_SD]
LED1  LEDCHIPLED_0805  [CHIPLED_0805]
LED2  LEDCHIPLED_0805  [CHIPLED_0805]
LED3  LEDCHIPLED_0805  [CHIPLED_0805]
LED4  LEDCHIPLED_0805  [CHIPLED_0805]
LED5  LEDCHIPLED_0805  [CHIPLED_0805]
LED6  LEDCHIPLED_0805  [CHIPLED_0805]
LED7  LEDCHIPLED_0805  [CHIPLED_0805]
LED8  LEDCHIPLED_0805  [CHIPLED_0805]
LED9  LEDCHIPLED_0805  [CHIPLED_0805]
R12  22  R-EU_R0805  [R0805]
R13  22  R-EU_R0805  [R0805]
R14  R-EU_R0805  [R0805]
R15  R-EU_R0805  [R0805]
R16  R-EU_R0805  [R0805]
R17  R-EU_R0805  [R0805]
R18  R-EU_R0805  [R0805]
R19  R-EU_R0805  [R0805]
R20  R-EU_R0805  [R0805]
R21  R-EU_R0805  [R0805]
R22  R-EU_R0805  [R0805]
R23  0  R-EU_R0805  [R0805]
S2  Boot  10-XXLSH  [B3F-10XX-SMD]
X3  MINI-USB-SCHIELD-32005-201  [32005-201]

### Nets
+3V3: IC3.6(P:VCC) ; also sheet 2,4,5,6,8,9
+5V: IC8.3(P:VCC)
CAN1_RX: IC8.4(D:RXD) ; also sheet 6
CAN1_TX: IC8.1(D:TXD) ; also sheet 6
GND: IC3.7(P:GND) IC8.2(P:GND) R23.1 X3.5 ; also sheet 2,3,4,5,6,8,9
N$16: R12.2 X3.2
N$17: R13.2 X3.3
N$18: LED1.A R14.1
N$19: LED2.A R15.1
N$20: LED3.A R16.1
N$21: LED4.A R17.1
N$22: LED5.A R18.1
N$23: LED6.A R19.1
N$24: LED7.A R20.1
N$25: LED8.A R21.1
N$26: LED9.A R22.1
N$31: IC8.8(D:RS) R23.2
USB_DM: R12.1 ; also sheet 6
USB_DP: R13.1 ; also sheet 6
USB_ID: X3.4 ; also sheet 6
USB_VBUS: X3.1 ; also sheet 6
Unconnected: IC3.1(S:SI) IC3.2(S:SCK) IC3.3(S:RESET) IC3.4(S:CS) IC3.5(S:WP) IC3.8(S:SO) IC8.5(D:VREF) IC8.6(D:CANL) IC8.7(D:CANH) JP6.1(DAT2) JP6.2(CD/DAT3) JP6.3(CMD) JP6.4(VDD) JP6.5(CLK) JP6.6(VSS) JP6.7(DAT0) JP6.8(DAT1) LED1.C LED2.C LED3.C LED4.C LED5.C LED6.C LED7.C LED8.C LED9.C R14.2 R15.2 R16.2 R17.2 R18.2 R19.2 R20.2 R21.2 R22.2 S2.P1(S) S2.P2(S1) S2.P3(P) S2.P4(P1) X3.M1(S:S1) X3.M2(S:S2) X3.M3(S:S3) X3.M4(S:S4)

### Buses
USB_VBUS,USB_DM,USB_DP,USB_ID
CAN1_RX,CAN1_TX

### Notes on the sheet
- Storage
- TODO: USB Supply
- TODO: Replace Micro SD Holder

## Sheet 8 of 9
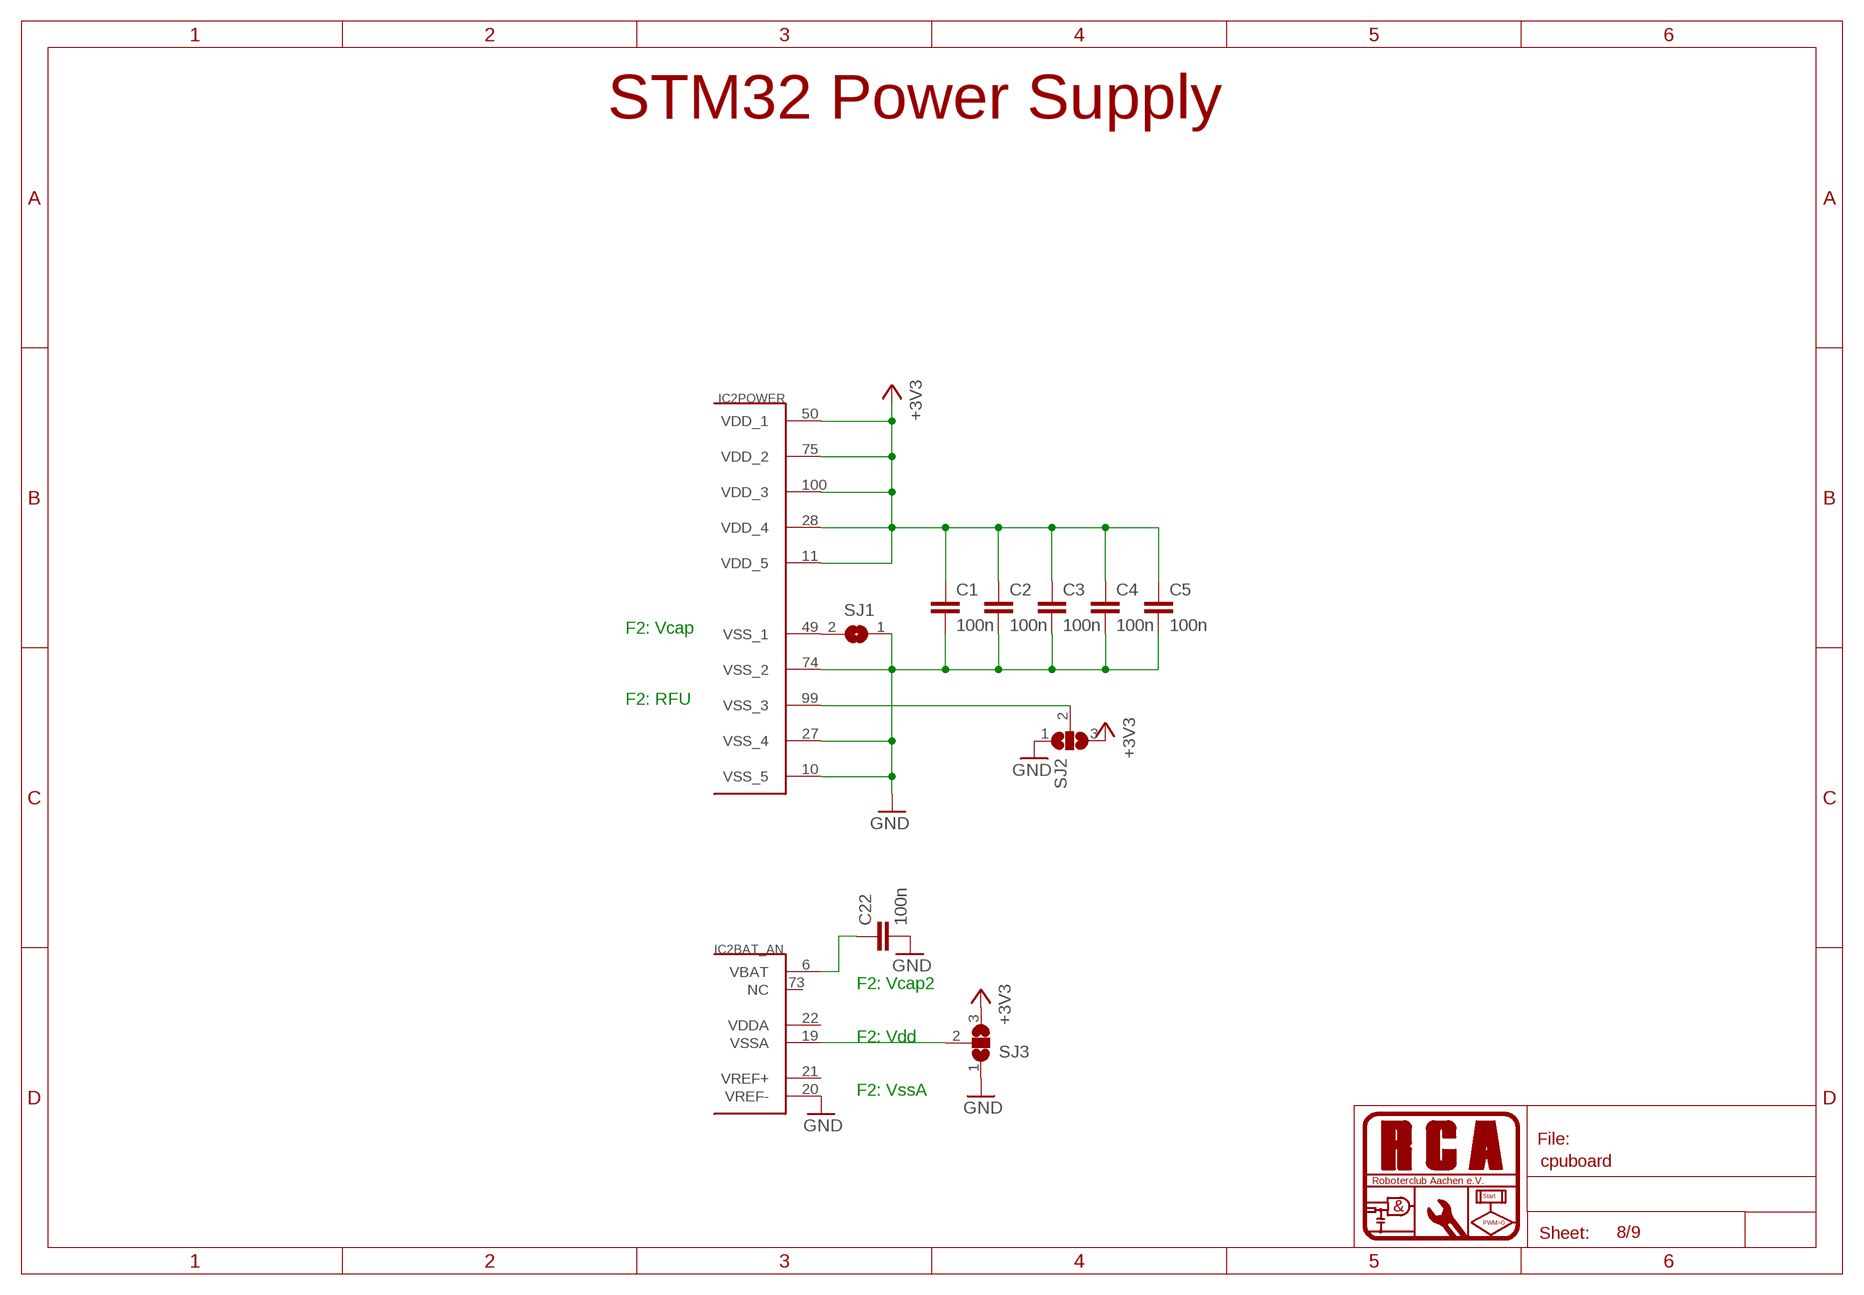
[diagram p7: schematic, sheet 8]

### Parts
C1  100n  C-EUC0603  [C0603]
C2  100n  C-EUC0603  [C0603]
C3  100n  C-EUC0603  [C0603]
C4  100n  C-EUC0603  [C0603]
C5  100n  C-EUC0603  [C0603]
C22  100n  C-EUC0603  [C0603]
SJ1  SJ  [SJ]
SJ2  SJ2W  [SJ_2]
SJ3  SJ2W  [SJ_2]

### Nets
+3V3: C1.1 C2.1 C3.1 C4.1 C5.1 IC2.11(POWER:VDD_5) IC2.28(POWER:VDD_4) IC2.50(POWER:VDD_1) IC2.75(POWER:VDD_2) IC2.100(POWER:VDD_3) SJ2.3 SJ3.3 ; also sheet 2,4,5,6,7,9
GND: C1.2 C2.2 C3.2 C4.2 C5.2 C22.2 IC2.10(POWER:VSS_5) IC2.20(BAT_AN:VREF-) IC2.27(POWER:VSS_4) IC2.74(POWER:VSS_2) SJ1.1 SJ2.1 SJ3.1 ; also sheet 2,3,4,5,6,7,9
N$27: C22.1 IC2.6(BAT_AN:VBAT)
N$28: IC2.99(POWER:VSS_3) SJ2.2
N$29: IC2.49(POWER:VSS_1) SJ1.2
N$30: IC2.19(BAT_AN:VSSA) SJ3.2
Unconnected: IC2.21(BAT_AN:VREF+) IC2.73(BAT_AN:NC)

### Notes on the sheet
- STM32 Power Supply
- F2: Vcap
- F2: RFU
- F2: Vcap2
- F2: Vdd
- F2: VssA

## Sheet 9 of 9
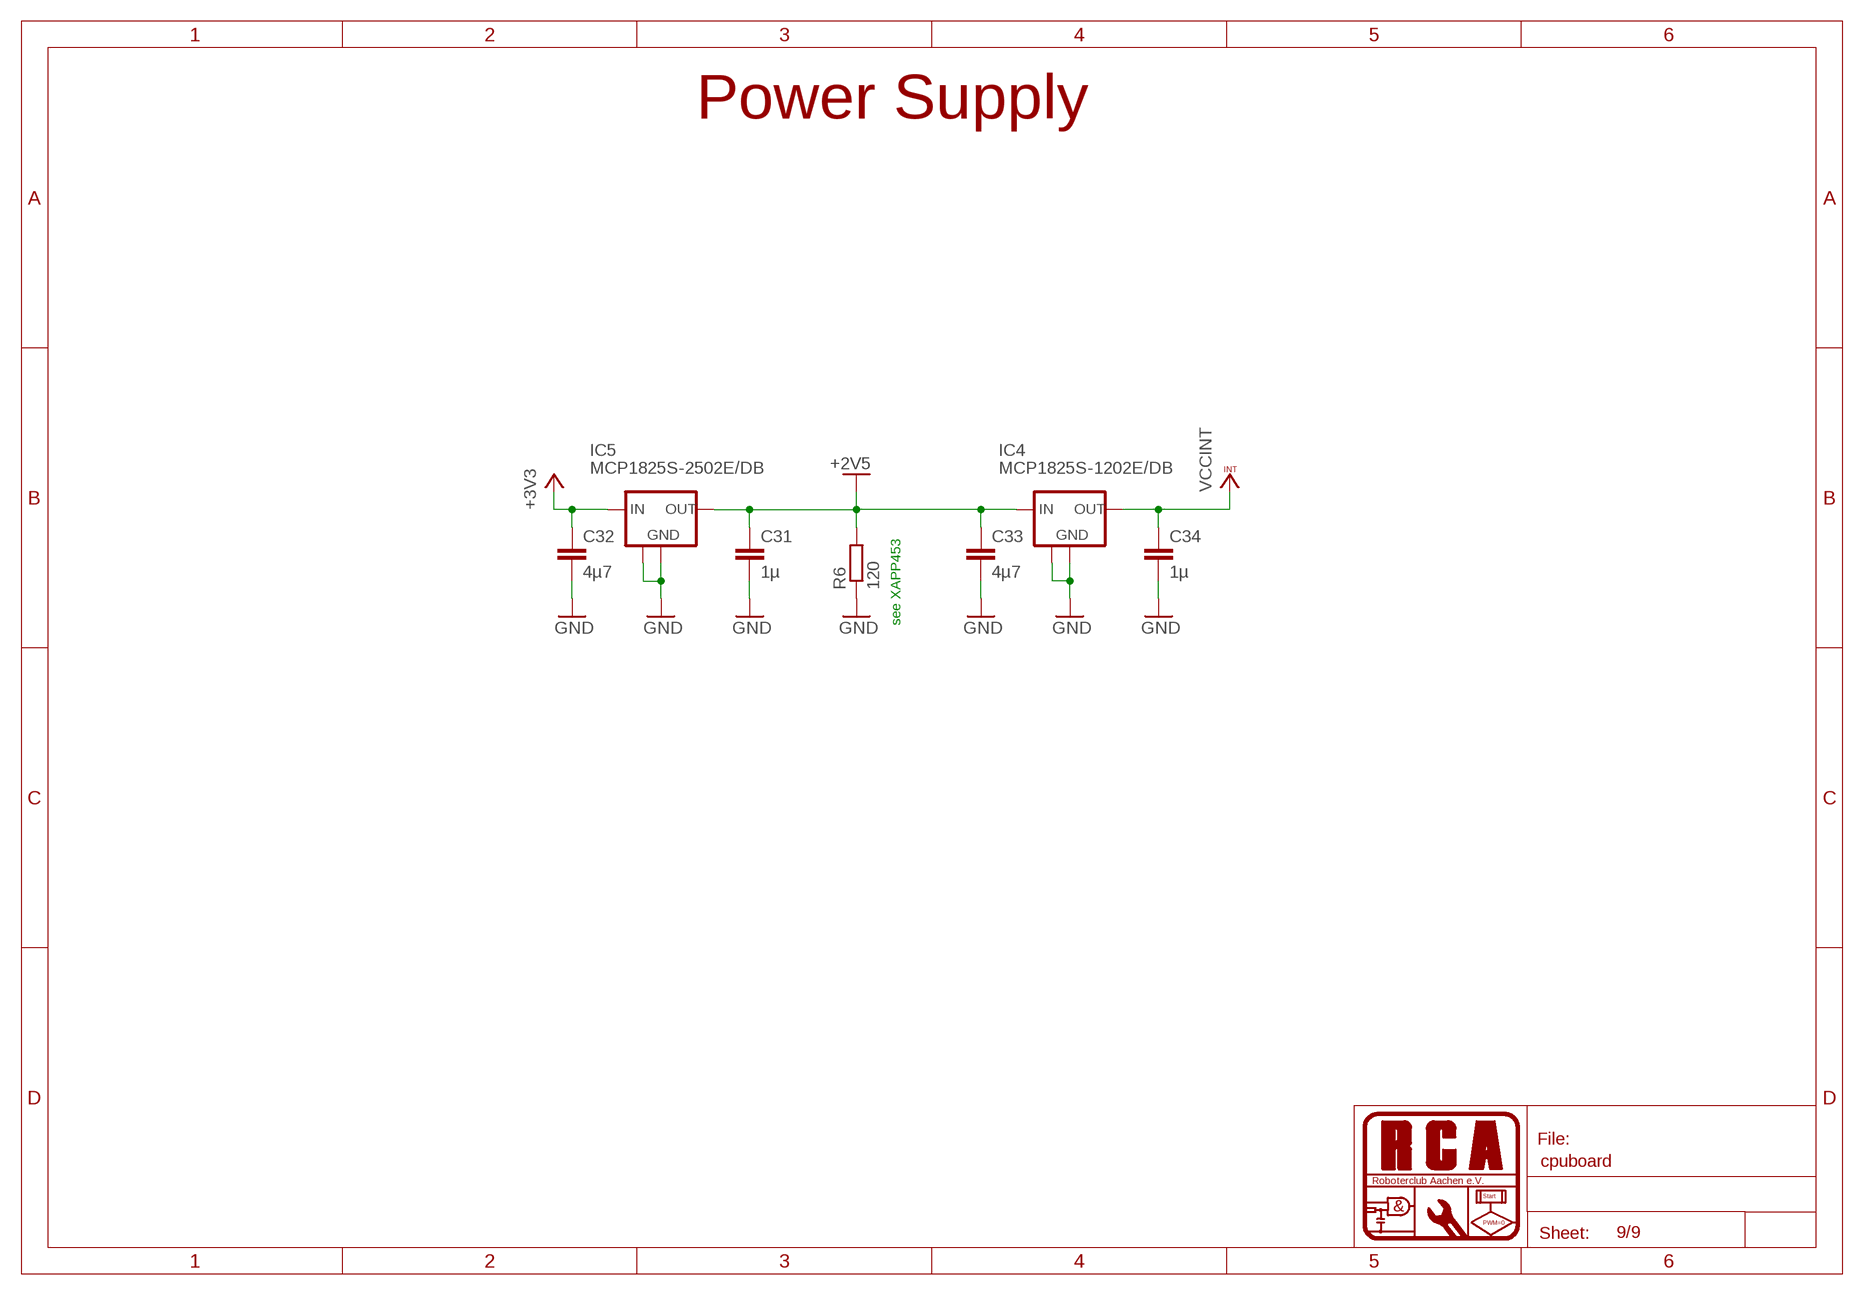
[diagram p8: schematic, sheet 9]

### Parts
C31  1µ  C-EUC0805  [C0805]
C32  4µ7  C-EUC0805  [C0805]
C33  4µ7  C-EUC0805  [C0805]
C34  1µ  C-EUC0805  [C0805]
IC4  MCP1825S-1202E/DB  MCP1825DB  [SOT223]
IC5  MCP1825S-2502E/DB  MCP1825DB  [SOT223]
R6  120  R-EU_M0805  [M0805]

### Nets
+2V5: C31.1 C33.1 IC4.1(IN) IC5.3(OUT) R6.2 ; also sheet 3,5
+3V3: C32.1 IC5.1(IN) ; also sheet 2,4,5,6,7,8
GND: C31.2 C32.2 C33.2 C34.2 IC4.2(GND) IC4.4(GND) IC5.2(GND) IC5.4(GND) R6.1 ; also sheet 2,3,4,5,6,7,8
VCCINT: C34.1 IC4.3(OUT) ; also sheet 5

### Notes on the sheet
- Power Supply
- see XAPP453

## Power pins joined to a net without a drawn wire
VDDA: IC2.22(BAT_AN:VDDA)

## Library data of the parts
C1-C34 = rcl:C-EU: CAPACITOR, European symbol
IC1 = xilinx:XC3S*TQ144: Spartan-3 FPGA Low-cost Field Programmable Gate Array. Some pins may be unavailable on the XC3S50, check the datasheet for more information.
IC2 = stm32:STM32F10XVXT6: STM32F101/103 100 pin LQFP
IC3 = rca_ic:AT45DB: AT45DBxxxD Single 2.5V or 2.7V to 3.6V Supply Serial Interface: 66 MHz Maximum Clock Frequency AT45DB041D: 4,325,376 bits of memory as 2,048 pages of 256 bytes
IC4 IC5 = rca_spgversorgung:MCP182*
IC6 = rca_ic:MCP3008: MCP3008 2.7V 4-Channel/8-Channel 10-Bit A/D Converters with SPI Serial Interface 10-bit resolution 4 (MCP3004) or 8 (MCP3008) input channels SPI serial interface (modes 0,0 and 1,1) Single supply operation: 2.7V - 5.5V 200 ksps max. sampling rate at VDD = 5V 75 ksps max. sampling rate at VDD = 2.7V Low power CMOS technology 5 nA typical standby current, 2 ?A max. 500 ?A max. active current at 5V Industrial temp range: -40°C to +85°C
IC8 = rca_ic:MCP2551: High-Speed CAN Transceiver
JP1 = rca_stecker:CORTEX_JTAG
JP2 = pinhead2:PINHD-2X5: PIN HEADER
JP3 = jumper:JP1E: JUMPER
JP6 = rca_stecker:SD
JP7 JP8 = pinhead2:PINHD-2X32
LED1-LED9 = led:LED: LED OSRAM: - CHIPLED LG R971, LG N971, LY N971, LG Q971, LY Q971, LO R971, LY R971 LH N974, LH R974 LS Q976, LO Q976, LY Q976 LO Q996 - Hyper CHIPLED LW Q18S LB Q993, LB Q99A, LB R99A - SideLED LS A670, LO A670, LY A670, LG A670, LP A670 LB A673, LV A673, LT A673, LW A673 LH A674 LY A675 LS A676, LA A676, LO A676, LY A676, LW A676 LS A679, LY A679, LG A679 - Hyper Micro SIDELED® LS Y876, LA Y876, LO Y876, LY Y876 LT Y87S - SmartLED LW L88C, LW L88S LB L89C, LB L89S, LG L890 LS L89K, LO L89K, LY L89K LS L896, LA L896, LO L896, LY L896 - TOPLED LS T670, LO T670, LY T670, LG T670, LP T670 LSG T670, LSP T670, LSY T670, LOP T670, LYG T670 LG T671, LOG T671, LSG T671 LB T673, LV T673, LT T673, LW T673 LH T674 LS T676, LA T676, LO T676, LY T676, LB T676, LH T676, LSB T676, LW T676 LB T67C, LV T67C, LT T67C, LS T67K, LO T67K, LY T67K, LW E67C LS E67B, LA E67B, LO E67B, LY E67B, LB E67C, LV E67C, LT E67C LW T67C LS T679, LY T679, LG T679 LS T770, LO T770, LY T770, LG T770, LP T770 LB T773, LV T773, LT T773, LW T773 LH T774 LS E675, LA E675, LY E675, LS T675 LS T776, LA T776, LO T776, LY T776, LB T776 LHGB T686 LT T68C, LB T68C - Hyper Mini TOPLED® LB M676 - Mini TOPLED Santana® LG M470 LS M47K, LO M47K, LY M47K Source: http://www.osram.convergy.de LUXEON: - LUMILED® LXK2-PW12-R00, LXK2-PW12-S00, LXK2-PW14-U00, LXK2-PW14-V00 LXK2-PM12-R00, LXK2-PM12-S00, LXK2-PM14-U00 LXK2-PE12-Q00, LXK2-PE12-R00, LXK2-PE12-S00, LXK2-PE14-T00, LXK2-PE14-U00 LXK2-PB12-K00, LXK2-PB12-L00, LXK2-PB12-M00, LXK2-PB14-N00, LXK2-PB14-P00, LXK2-PB14-Q00 LXK2-PR12-L00, LXK2-PR12-M00, LXK2-PR14-Q00, LXK2-PR14-R00 LXK2-PD12-Q00, LXK2-PD12-R00, LXK2-PD12-S00 LXK2-PH12-R00, LXK2-PH12-S00 LXK2-PL12-P00, LXK2-PL12-Q00, LXK2-PL12-R00 Source: www.luxeon.com KINGBRIGHT: KA-3528ASYC Source: www.kingbright.com
Q1 Q2 = rca_sontiges:XO: XO91 Series Oscillators Frequency Range 500 kHz to 125 MHz Supply voltage range 1.8, 2.5, 3.3 or 5.0 Volts Gibt es in der 3,3V Version bei Reichelt (XO91 #Wert) Datenblatt: http://www.reichelt.de/?;ACTION=7;LA=6;OPEN=0;INDEX=0;FILENAME=B400%252FXO91.pdf XO53 Series Oscillators Frequency Range 2.5 MHz to 125 MHz Supply voltage range 1.8, 2.5, 3.3 Volts Gibt es in der 3,3V Version bei Reichelt (XO53 #Wert)
R1-R25 = rcl:R-EU_: RESISTOR, European symbol
S1 S2 = rca_sontiges:10-XX*: OMRON SWITCH
SJ1 SJ4 = jumper:SJ: SMD solder JUMPER
SJ2 SJ3 = jumper:SJ2W: SMD solder JUMPER
X3 = con-cypressindustries:MINI-USB-SCHIELD-: MINI USB-B Conector Source: www.cypressindustries.com

## Board
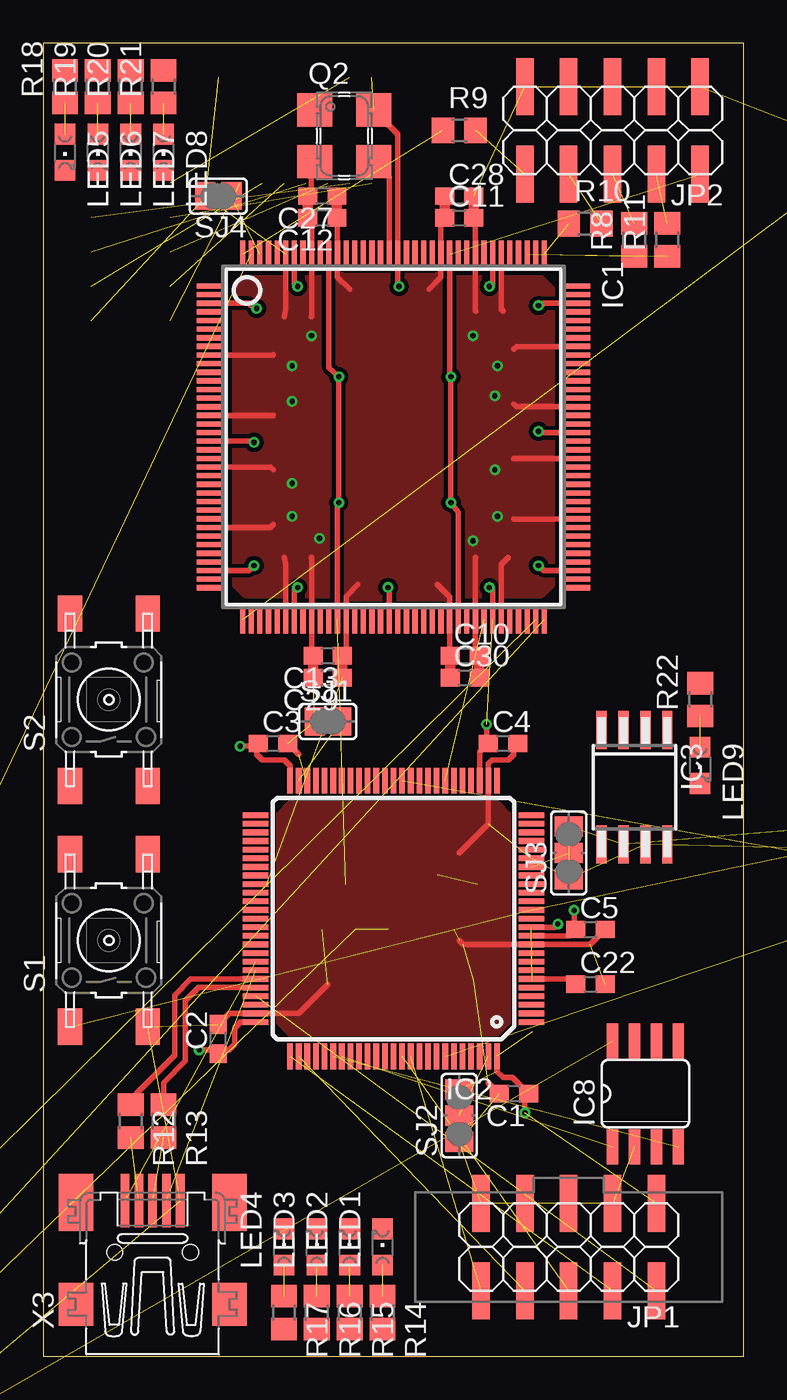
[diagram p9: board, top side]
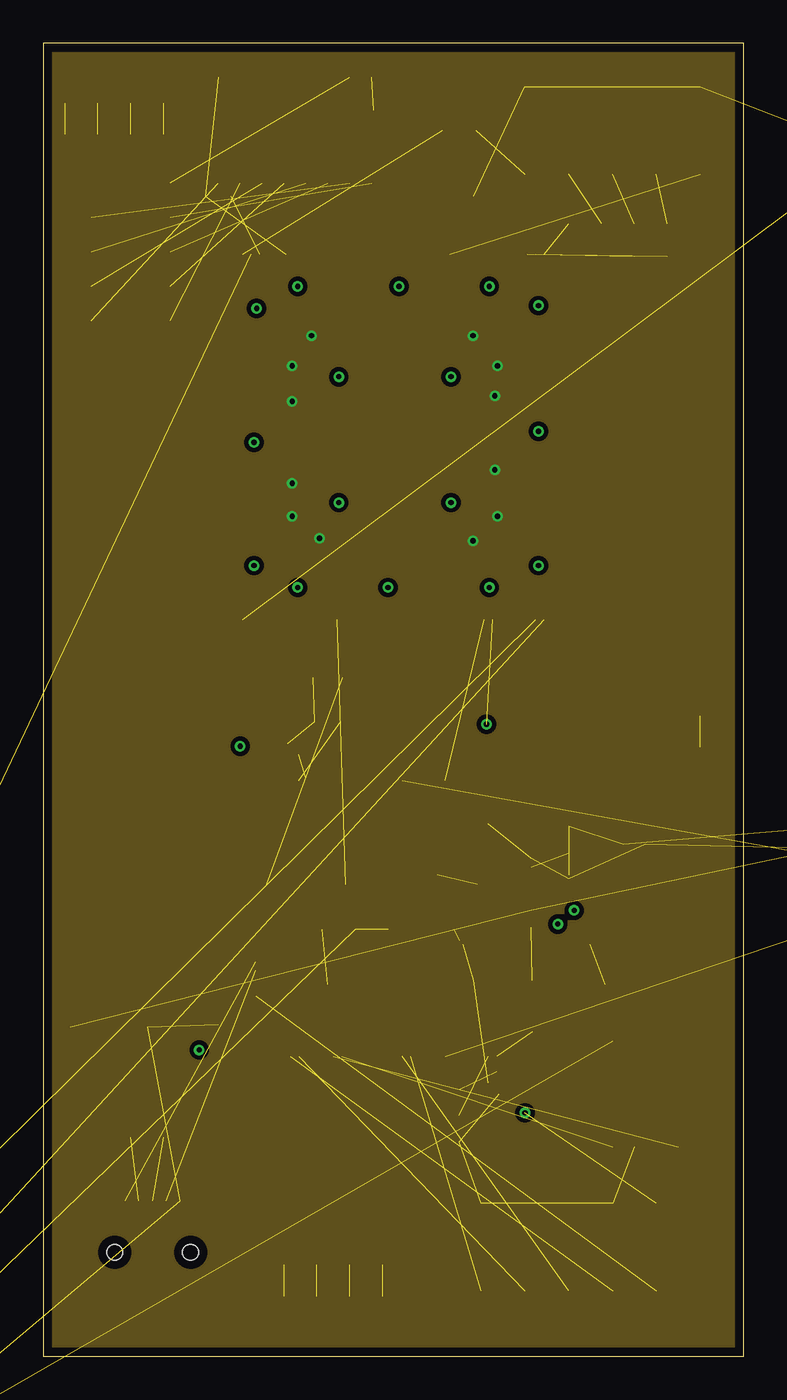
[diagram p10: board, inner layer GND]
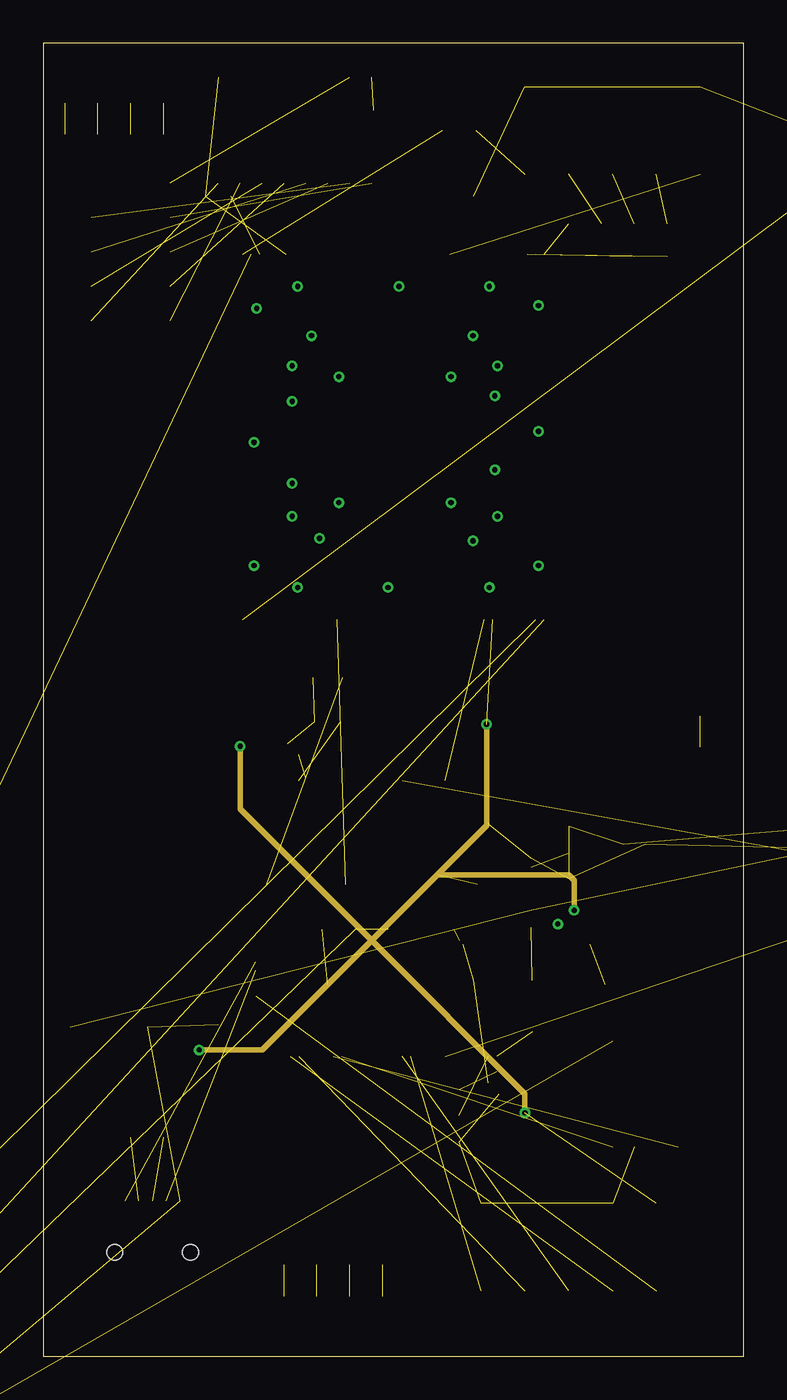
[diagram p11: board, inner layer Route15]
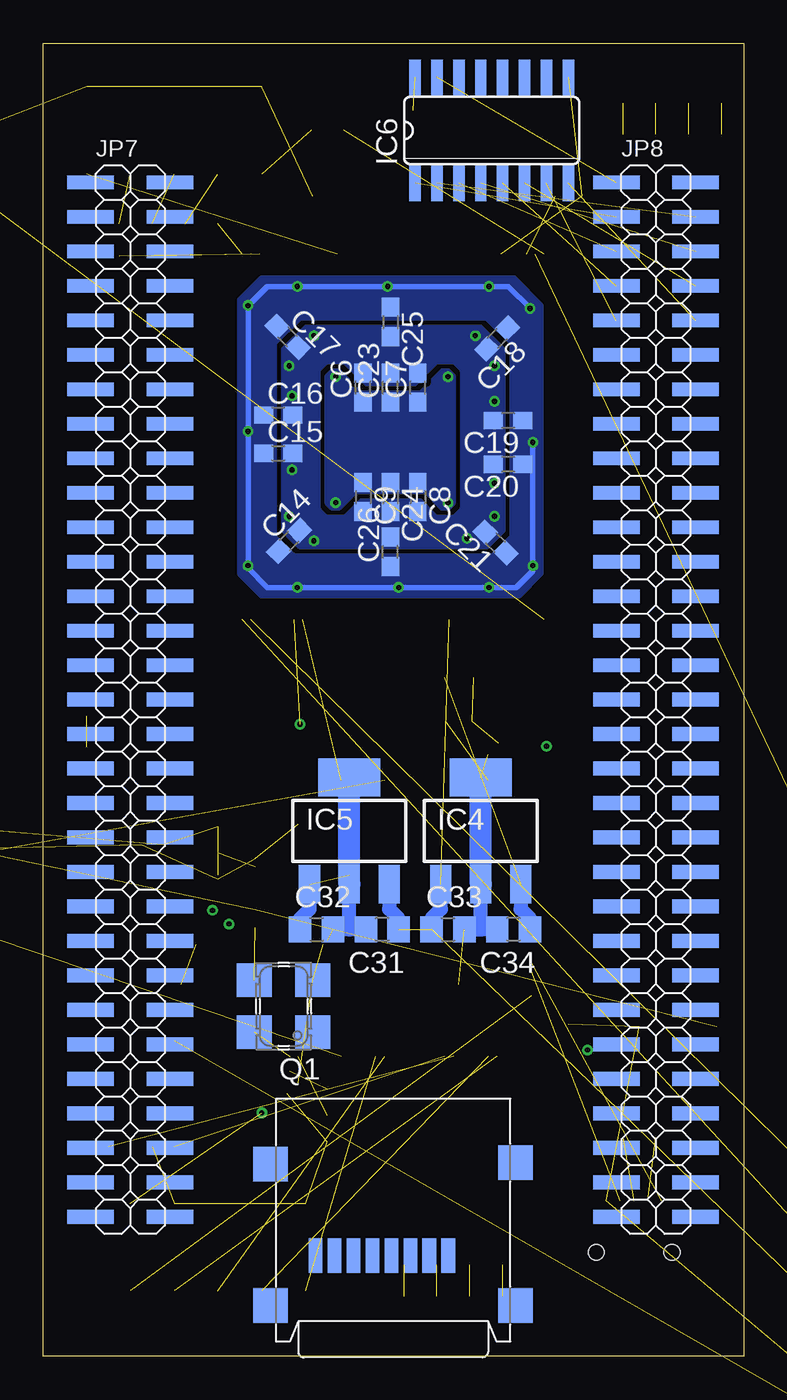
[diagram p12: board, bottom side, seen from below]

Size 40.62 x 76.19 mm. Coordinates in mm from the lower left corner, seen from the top.
Outline: 0,0 40.62,0 40.62,76.19 0,76.19 0,0
Copper layers (1+2*15+16): Top 0.035mm / dielectric 1.5mm / GND 0.035mm / dielectric 0.15mm / Route15 0.035mm / dielectric 0.2mm / Bottom 0.035mm
Design rules "PCB-POOL *": minimum track width 6mil, minimum drill 12mil, track to track 6mil, track to pad 6mil, pad to pad 6mil, via to via 6mil, smd to smd 6mil, copper to edge 20mil, drill to drill 8mil, minimum pad ring 8mil, minimum via ring 6mil, stop-mask expansion 3mil, vias tented up to drill 12mil, thermal gap 8mil

### Footprints (pad centres in the part's own frame; a part is rotated, then mirrored left to right if it is on the bottom)
C0603 = smd 1.1 x 1: 1 -0.85,0; 2 0.85,0
C0805 = smd 1.3 x 1.5: 1 -0.95,0; 2 0.95,0
TQ144 = smd 0.3 x 1.6: 1 -8.75,-10.6; 2 -8.25,-10.6; 3 -7.75,-10.6; 4 -7.25,-10.6; 5 -6.75,-10.6; 6 -6.25,-10.6; 7 -5.75,-10.6; 8 -5.25,-10.6; 9 -4.75,-10.6; 10 -4.25,-10.6; 11 -3.75,-10.6; 12 -3.25,-10.6; 13 -2.75,-10.6; 14 -2.25,-10.6; 15 -1.75,-10.6; 16 -1.25,-10.6; 17 -0.75,-10.6; 18 -0.25,-10.6; 19 0.25,-10.6; 20 0.75,-10.6; 21 1.25,-10.6; 22 1.75,-10.6; 23 2.25,-10.6; 24 2.75,-10.6; 25 3.25,-10.6; 26 3.75,-10.6; 27 4.25,-10.6; 28 4.75,-10.6; 29 5.25,-10.6; 30 5.75,-10.6; 31 6.25,-10.6; 32 6.75,-10.6; 33 7.25,-10.6; 34 7.75,-10.6; 35 8.25,-10.6; 36 8.75,-10.6; 73 8.75,10.6; 74 8.25,10.6; 75 7.75,10.6; 76 7.25,10.6; 77 6.75,10.6; 78 6.25,10.6; 79 5.75,10.6; 80 5.25,10.6; 81 4.75,10.6; 82 4.25,10.6; 83 3.75,10.6; 84 3.25,10.6; 85 2.75,10.6; 86 2.25,10.6; 87 1.75,10.6; 88 1.25,10.6; 89 0.75,10.6; 90 0.25,10.6; 91 -0.25,10.6; 92 -0.75,10.6; 93 -1.25,10.6; 94 -1.75,10.6; 95 -2.25,10.6; 96 -2.75,10.6; 97 -3.25,10.6; 98 -3.75,10.6; 99 -4.25,10.6; 100 -4.75,10.6; 101 -5.25,10.6; 102 -5.75,10.6; 103 -6.25,10.6; 104 -6.75,10.6; 105 -7.25,10.6; 106 -7.75,10.6; 107 -8.25,10.6; 108 -8.75,10.6 | smd 1.6 x 0.3: 37 10.6,-8.75; 38 10.6,-8.25; 39 10.6,-7.75; 40 10.6,-7.25; 41 10.6,-6.75; 42 10.6,-6.25; 43 10.6,-5.75; 44 10.6,-5.25; 45 10.6,-4.75; 46 10.6,-4.25; 47 10.6,-3.75; 48 10.6,-3.25; 49 10.6,-2.75; 50 10.6,-2.25; 51 10.6,-1.75; 52 10.6,-1.25; 53 10.6,-0.75; 54 10.6,-0.25; 55 10.6,0.25; 56 10.6,0.75; 57 10.6,1.25; 58 10.6,1.75; 59 10.6,2.25; 60 10.6,2.75; 61 10.6,3.25; 62 10.6,3.75; 63 10.6,4.25; 64 10.6,4.75; 65 10.6,5.25; 66 10.6,5.75; 67 10.6,6.25; 68 10.6,6.75; 69 10.6,7.25; 70 10.6,7.75; 71 10.6,8.25; 72 10.6,8.75; 109 -10.6,8.75; 110 -10.6,8.25; 111 -10.6,7.75; 112 -10.6,7.25; 113 -10.6,6.75; 114 -10.6,6.25; 115 -10.6,5.75; 116 -10.6,5.25; 117 -10.6,4.75; 118 -10.6,4.25; 119 -10.6,3.75; 120 -10.6,3.25; 121 -10.6,2.75; 122 -10.6,2.25; 123 -10.6,1.75; 124 -10.6,1.25; 125 -10.6,0.75; 126 -10.6,0.25; 127 -10.6,-0.25; 128 -10.6,-0.75; 129 -10.6,-1.25; 130 -10.6,-1.75; 131 -10.6,-2.25; 132 -10.6,-2.75; 133 -10.6,-3.25; 134 -10.6,-3.75; 135 -10.6,-4.25; 136 -10.6,-4.75; 137 -10.6,-5.25; 138 -10.6,-5.75; 139 -10.6,-6.25; 140 -10.6,-6.75; 141 -10.6,-7.25; 142 -10.6,-7.75; 143 -10.6,-8.25; 144 -10.6,-8.75
TQFP100 = smd 1.5 x 0.33: 1 -8,6; 2 -8,5.5; 3 -8,5; 4 -8,4.5; 5 -8,4; 6 -8,3.5; 7 -8,3; 8 -8,2.5; 9 -8,2; 10 -8,1.5; 11 -8,1; 12 -8,0.5; 13 -8,0; 14 -8,-0.5; 15 -8,-1; 16 -8,-1.5; 17 -8,-2; 18 -8,-2.5; 19 -8,-3; 20 -8,-3.5; 21 -8,-4; 22 -8,-4.5; 23 -8,-5; 24 -8,-5.5; 25 -8,-6; 51 8,-6; 52 8,-5.5; 53 8,-5; 54 8,-4.5; 55 8,-4; 56 8,-3.5; 57 8,-3; 58 8,-2.5; 59 8,-2; 60 8,-1.5; 61 8,-1; 62 8,-0.5; 63 8,0; 64 8,0.5; 65 8,1; 66 8,1.5; 67 8,2; 68 8,2.5; 69 8,3; 70 8,3.5; 71 8,4; 72 8,4.5; 73 8,5; 74 8,5.5; 75 8,6 | smd 0.33 x 1.5: 26 -6,-8; 27 -5.5,-8; 28 -5,-8; 29 -4.5,-8; 30 -4,-8; 31 -3.5,-8; 32 -3,-8; 33 -2.5,-8; 34 -2,-8; 35 -1.5,-8; 36 -1,-8; 37 -0.5,-8; 38 0,-8; 39 0.5,-8; 40 1,-8; 41 1.5,-8; 42 2,-8; 43 2.5,-8; 44 3,-8; 45 3.5,-8; 46 4,-8; 47 4.5,-8; 48 5,-8; 49 5.5,-8; 50 6,-8; 76 6,8; 77 5.5,8; 78 5,8; 79 4.5,8; 80 4,8; 81 3.5,8; 82 3,8; 83 2.5,8; 84 2,8; 85 1.5,8; 86 1,8; 87 0.5,8; 88 0,8; 89 -0.5,8; 90 -1,8; 91 -1.5,8; 92 -2,8; 93 -2.5,8; 94 -3,8; 95 -3.5,8; 96 -4,8; 97 -4.5,8; 98 -5,8; 99 -5.5,8; 100 -6,8
SO-08M = smd 0.6 x 2.2: 1 -1.905,-3.33; 2 -0.635,-3.33; 3 0.635,-3.33; 4 1.905,-3.33; 5 1.905,3.33; 6 0.635,3.33; 7 -0.635,3.33; 8 -1.905,3.33
SOT223 = smd 1.219 x 2.235: 1 -2.311,-3.099; 2 0,-3.099; 3 2.311,-3.099 | smd 3.6 x 2.2: 4 0,3.099
SO16 = smd 0.66 x 2.032: 1 -4.445,-3.073; 2 -3.175,-3.073; 3 -1.905,-3.073; 4 -0.635,-3.073; 5 0.635,-3.073; 6 1.905,-3.073; 7 3.175,-3.073; 8 4.445,-3.073; 9 4.445,3.073; 10 3.175,3.073; 11 1.905,3.073; 12 0.635,3.073; 13 -0.635,3.073; 14 -1.905,3.073; 15 -3.175,3.073; 16 -4.445,3.073
SOIC-8 = smd 2.032 x 0.66: 1 -3.073,1.27; 2 -3.073,0; 3 -3.073,-1.27; 4 -3.073,-2.54; 5 3.073,-2.54; 6 3.073,-1.27; 7 3.073,0; 8 3.073,1.27
2X05SMD = smd 1.016 x 3.302: 1 -5.08,-2.54; 2 -5.08,2.54; 3 -2.54,-2.54; 4 -2.54,2.54; 5 0,-2.54; 6 0,2.54; 7 2.54,-2.54; 8 2.54,2.54; 9 5.08,-2.54; 10 5.08,2.54
2X05SMD' = smd 1.016 x 3.302: 1 -1.27,-3.81; 2 -1.27,1.27; 3 1.27,-3.81; 4 1.27,1.27; 5 3.81,-3.81; 6 3.81,1.27; 7 6.35,-3.81; 8 6.35,1.27; 9 8.89,-3.81; 10 8.89,1.27
JP1 = drill 0.914 long: 1 0,-1.27; 2 0,1.27
MICRO_SD = smd 0.8 x 2: 1 -3.2,0.5; 2 -2.1,0.5; 3 -1,0.5; 4 0.1,0.5; 5 1.2,0.5; 6 2.3,0.5; 7 3.4,0.5; 8 4.5,0.5 | smd 2 x 2: 9 7.1,3.4; 10 7.1,-4.8; 11 -7.1,-4.9; 12 -7.1,3.4
2X32M_SMD = smd 0.8 x 2.7: 1 -30,-2.3; 2 -30,2.3; 3 -28,-2.3; 4 -28,2.3; 5 -26,-2.3; 6 -26,2.3; 7 -24,-2.3; 8 -24,2.3; 9 -22,-2.3; 10 -22,2.3; 11 -20,-2.3; 12 -20,2.3; 13 -18,-2.3; 14 -18,2.3; 15 -16,-2.3; 16 -16,2.3; 17 -14,-2.3; 18 -14,2.3; 19 -12,-2.3; 20 -12,2.3; 21 -10,-2.3; 22 -10,2.3; 23 -8,-2.3; 24 -8,2.3; 25 -6,-2.3; 26 -6,2.3; 27 -4,-2.3; 28 -4,2.3; 29 -2,-2.3; 30 -2,2.3; 31 0,-2.3; 32 0,2.3; 33 2,-2.3; 34 2,2.3; 35 4,-2.3; 36 4,2.3; 37 6,-2.3; 38 6,2.3; 39 8,-2.3; 40 8,2.3; 41 10,-2.3; 42 10,2.3; 43 12,-2.3; 44 12,2.3; 45 14,-2.3; 46 14,2.3; 47 16,-2.3; 48 16,2.3; 49 18,-2.3; 50 18,2.3; 51 20,-2.3; 52 20,2.3; 53 22,-2.3; 54 22,2.3; 55 24,-2.3; 56 24,2.3; 57 26,-2.3; 58 26,2.3; 59 28,-2.3; 60 28,2.3; 61 30,-2.3; 62 30,2.3
CHIPLED_0805 = smd 1.2 x 1.2: A 0,-1.05; C 0,1.05
XO53 = smd 1.93 x 2.032: 1 -1.5,-1.7; 2 1.5,-1.7; 3 1.5,1.7; 4 -1.5,1.7
R0805 = smd 1.3 x 1.5: 1 -0.95,0; 2 0.95,0
M0805 = smd 1.3 x 1.6: 1 -0.95,0; 2 0.95,0
B3F-10XX-SMD = smd 2.1 x 1.4: P1 -5,2.25; P2 5,2.25; P3 -5,-2.25; P4 5,-2.25
SJ = smd 1.168 x 1.6: 1 -0.762,0; 2 0.762,0
SJ_2 = smd 1.168 x 1.6: 1 -1.524,0; 2 0,0; 3 1.524,0
32005-201 = smd 3.1 x 0.5: 1 3,1.6; 2 3,0.8; 3 3,0; 4 3,-0.8; 5 3,-1.6 | smd 2.5 x 2: M1 -3,-4.45; M2 -3,4.45 | smd 3.3 x 2: M3 2.9,4.45; M4 2.9,-4.45 | hole 0.9: 0,2.2; 0,-2.2

### Placement (x,y rotation side)
C1  27.3,15.24 180 top
C2  10.16,18.41 90 top
C3  13.34,35.56 0 top
C4  26.67,35.56 0 top
C5  31.75,24.77 0 top
C6  22.07,56.2 90 bottom
C7  18.89,56.2 90 bottom
C8  18.89,49.85 270 bottom
C9  22.07,49.85 270 bottom
C10  24.45,40.64 0 top
C11  24.13,66.04 0 top
C12  16.19,66.04 180 top
C13  16.51,40.64 180 top
C14  26.35,47.31 45 bottom
C15  26.99,52.39 0 bottom
C16  26.99,54.61 0 bottom
C17  26.45,59.15 315 bottom
C18  14.29,59.05 225 bottom
C19  13.65,54.29 180 bottom
C20  13.65,51.75 180 bottom
C21  14.38,47.21 135 bottom
C22  31.75,21.59 0 top
C23  20.48,56.2 90 bottom
C24  20.48,49.85 270 bottom
C25  20.48,60.01 270 bottom
C26  20.48,46.67 90 bottom
C27  16.19,67.31 180 top
C28  24.13,67.31 0 top
C29  16.51,39.37 180 top
C30  24.45,39.37 0 top
C31  20.95,24.77 180 bottom
C32  24.77,24.77 0 bottom
C33  17.14,24.77 0 bottom
C34  13.34,24.77 180 bottom
IC1  20.32,53.34 270 top
IC2  20.32,25.4 180 top
IC3  34.29,33.02 180 top
IC4  15.24,30.48 0 bottom
IC5  22.86,30.48 0 bottom
IC6  14.61,71.12 0 bottom
IC8  34.29,15.24 90 top
JP1  30.48,6.35 180 top
JP2  FPGA JTAG  [2X05SMD']  36.83,69.85 180 top
JP3  48.26,69.22 270 top  (outside the outline)
JP6  20.32,6.35 180 bottom
JP7  35.56,38.1 270 bottom
JP8  5.08,38.1 270 bottom
LED1  19.68,6.35 0 top
LED2  17.78,6.35 0 top
LED3  15.88,6.35 0 top
LED4  13.97,6.35 0 top
LED5  1.27,69.85 180 top
LED6  3.17,69.85 180 top
LED7  5.08,69.85 180 top
LED8  6.99,69.85 180 top
LED9  38.1,34.29 180 top
Q1  26.67,20.32 90 bottom
Q2  17.46,70.8 270 top
R1  -12.7,-3.81 0 top  (outside the outline)
R2  57.15,26.67 0 top  (outside the outline)
R3  57.15,29.21 0 top  (outside the outline)
R4  57.15,31.75 0 top  (outside the outline)
R5  -19.05,-3.81 0 top  (outside the outline)
R6  -19.05,-10.16 0 top  (outside the outline)
R7  -24.13,-10.16 0 top  (outside the outline)
R8  34.29,64.77 90 top
R9  24.13,71.12 0 top
R10  31.43,65.72 0 top
R11  36.2,64.77 90 top
R12  5.08,13.65 270 top
R13  6.99,13.65 270 top
R14  19.68,2.54 270 top
R15  17.78,2.54 270 top
R16  15.88,2.54 270 top
R17  13.97,2.54 270 top
R18  1.27,73.66 90 top
R19  3.17,73.66 90 top
R20  5.08,73.66 90 top
R21  6.99,73.66 90 top
R22  38.1,38.1 90 top
R23  -6.35,-3.81 0 top  (outside the outline)
R24  -30.48,-10.16 0 top  (outside the outline)
R25  -36.83,-10.16 0 top  (outside the outline)
S1  3.81,24.13 90 top
S2  3.81,38.1 90 top
SJ1  16.51,36.83 0 top
SJ2  24.13,13.97 90 top
SJ3  30.48,29.21 90 top
SJ4  10.16,67.31 180 top
X3  6.35,6.03 90 top

### Tracks (layer width: path | path; a pad name or v marks a point on that pad's centre or on a via)
!RESET  (2 unrouted)
+2V5  (via drill 0.3)  (6 unrouted)
  Top 0.305: IC1.120 23.57,57.08 v23.65,56.83 v23.65,49.53 24.07,48.99 IC1.62 | IC1.134 16.57,57.37 v17.14,56.83 v17.14,49.53 17.07,49.45 IC1.48
  Bottom 0.813: IC4.1 17.55,25.95 18.1,25.4 C33.1 | IC5.3 20.55,25.95 20,25.4 C31.1
  pour Bottom (isolate 0.254, no thermals): 16.83,49.53 17.14,49.21 17.46,49.21 18.41,50.16 22.54,50.16 23.5,49.21 23.81,49.21 24.13,49.53 24.13,56.83 23.81,57.15 23.5,57.15 22.23,55.88 18.73,55.88 17.46,57.15 17.14,57.15 16.83,56.83
+3V3  (via drill 0.3)  (9 unrouted)
  Top 0.305: IC2.75 11.46,19.4 11.11,19.05 11.11,18.1 10.79,17.78 10.38,17.78 C2.1 10.16,17.78 v9.05,17.78 | IC2.100 26.32,16.54 26.67,16.19 27.2,16.19 C1.1 27.94,15.24 v27.94,14.13 | IC2.28 25.32,35.06 C4.1 25.72,35.66 v25.72,36.67 | IC2.50 14.32,34.26 13.97,34.61 12.7,34.61 12.38,34.92 12.38,35.46 C3.1 12.38,35.56 12.38,35.4 v11.43,35.4 | IC2.11 30.54,24.4 C5.1 30.8,24.77 v30.8,25.88 | IC1.115 26.07,62.27 v25.88,62.07 | IC1.106 29.02,61.09 28.89,60.96 28.86,61.09 v28.73,60.96 | IC1.91 28.8,53.59 v28.73,53.66 | IC1.75 29.02,45.59 28.89,45.72 28.6,45.91 v28.73,45.88 | IC1.66 26.07,44.41 v25.88,44.61 | IC1.54 20.07,44.7 v20,44.61 | IC1.43 14.57,44.41 v14.76,44.61 | IC1.3 11.94,61.09 12.06,60.96 12.35,60.77 v12.38,60.8 | IC1.138 14.57,62.27 v14.76,62.07 | v20.64,62.07 20.57,62.14 IC1.126 20.57,70.89 Q2.4 | IC1.19 12.16,53.09 v12.22,53.02 | IC1.34 11.94,45.59 12.06,45.72 12.2,45.91 v12.22,45.88
  Route15 0.305: v9.05,17.78 12.7,17.78 19.05,24.13 | v27.94,14.13 27.94,15.24 19.05,24.13 | v11.43,35.4 11.43,31.75 19.05,24.13 | v25.72,36.67 25.72,30.8 22.86,27.94 | 22.86,27.94 30.48,27.94 30.8,27.62 v30.8,25.88 | 19.05,24.13 22.86,27.94
  Bottom 0.305: v12.22,53.02 v12.22,45.88 12.22,45.56 13.18,44.61 v14.76,44.61 16.03,44.61 v20,44.61 24.77,44.61 v25.88,44.61 27.62,44.61 28.73,45.72 v28.73,45.88 v28.73,53.66 v28.73,60.96 27.62,62.07 v25.88,62.07 v20.64,62.07 16.99,62.07 15.88,62.07 v14.76,62.07 13.65,62.07 v12.38,60.8
  Bottom 0.813: IC5.1 25.17,25.95 25.72,25.4 C32.1
  pour Bottom (isolate 0.254, rank 3, no thermals): 11.75,60.96 13.34,62.55 27.94,62.55 29.21,61.28 29.21,45.4 27.94,44.13 13.02,44.13 11.75,45.4
BOOT1  (1 unrouted)
CAN1_RX  (1 unrouted)
CAN1_TX  (1 unrouted)
FPGA_ADC0  (1 unrouted)
FPGA_ADC1  (1 unrouted)
FPGA_ADC2  (1 unrouted)
FPGA_ADC3  (1 unrouted)
FPGA_ADC4  (1 unrouted)
FPGA_ADC5  (1 unrouted)
FPGA_ADC6  (1 unrouted)
FPGA_ADC7  (1 unrouted)
FPGA_ADC_VREF  (1 unrouted)
GND  (via drill 0.3)  (30 unrouted)
  Top 0.305: C2.2 10.79,19.9 IC2.74 14.82,19.9 16.51,21.59 | C1.2 25.82,15.88 | C4.2 27.3,35.34 27.3,34.92 26.99,34.61 26.04,34.61 25.82,34.39 IC2.27 25.82,30.9 24.13,29.21 | 14.82,34.92 C3.2 | 24.13,24.13 24.36,23.9 IC2.10 31.73,23.9 C5.2 | IC1.29 13.16,48.09 13.34,48.26 | IC1.22 13.18,51.59 13.34,51.44 | IC1.16 13.31,54.59 13.34,54.61 | IC1.9 13.32,58.09 13.34,58.1 | 15.56,60.33 15.57,60.34 IC1.136 15.57,65.95 C12.2 | IC1.139 14.07,60.74 13.97,60.33 | 25.08,60.64 25.07,60.66 IC1.117 25.07,65.95 C11.2 | IC1.114 26.57,60.74 26.67,60.64 | IC1.101 27.48,58.59 27.3,58.42 | IC1.94 27.46,55.09 27.3,55.24 | IC1.88 27.32,52.09 27.3,52.07 | IC1.81 27.32,48.59 27.3,48.58 | IC1.42 14.07,45.94 13.97,46.35 | 15.56,46.35 15.57,46.34 IC1.45 15.57,40.73 C13.2 | IC1.67 26.57,45.94 26.99,46.35 | 25.08,46.35 25.07,46.34 IC1.64 25.07,40.87 C10.2 | Q2.2 15.76,68.78 15.56,68.58 15.56,67.53 C27.2
  Top 0.61: C29.2 C13.2 | C30.2 C10.2 | C12.2 C27.2 | C11.2 C28.2
  Bottom 0.813: 22.86,24.77 IC5.2 | C31.2 22.86,24.77 | 22.86,24.77 C32.2 | IC4.2 15.24,24.77 C33.2 C34.2
  Bottom 1.27: IC4.2 IC4.4 | IC5.2 IC5.4
  other vias: 15.56,59.21 14.45,57.47 14.45,55.4 14.45,50.64 14.45,48.74 16.03,47.47 24.92,47.31 26.35,48.74 26.19,51.44 26.19,55.72 26.35,57.47 24.92,59.21
  pour Top (isolate 0.305): 13.65,31.43 14.29,32.07 26.35,32.07 26.99,31.43 26.99,19.37 26.35,18.73 14.29,18.73 13.65,19.37
  pour GND (isolate 0.254): -1.27,77.47 41.91,77.47 41.91,-1.27 -1.27,-1.27
  pour Bottom (isolate 0.254, rank 2, no thermals): 25.72,46.99 14.92,46.99 13.97,47.94 13.97,58.42 15.24,59.69 25.4,59.69 26.67,58.42 26.67,48.26 26.67,47.94
  pour Top (isolate 0.254, rank 2): 11.11,44.77 11.75,44.13 28.89,44.13 29.53,44.77 29.53,61.91 28.89,62.55 11.75,62.55 11.11,61.91
N$1  (via drill 0.3)  (1 unrouted)
  Top 0.305: IC2.12 29.66,24.9 v29.84,25.08
N$2  (2 unrouted)
N$3  (2 unrouted)
N$4  (1 unrouted)
N$5  (1 unrouted)
N$6  (1 unrouted)
N$7  (1 unrouted)
N$8  (1 unrouted)
N$9  (1 unrouted)
N$10  (1 unrouted)
N$11  (1 unrouted)
N$12  (1 unrouted)
N$13  (1 unrouted)
N$14  (1 unrouted)
N$15  (1 unrouted)
N$16  (1 unrouted)
N$17  (1 unrouted)
N$18  (1 unrouted)
N$19  (1 unrouted)
N$20  (1 unrouted)
N$21  (1 unrouted)
N$22  (1 unrouted)
N$23  (1 unrouted)
N$24  (1 unrouted)
N$25  (1 unrouted)
N$26  (1 unrouted)
N$27
  Top 0.305: IC2.6 30.59,21.9 C22.1
N$28  (1 unrouted)
N$29  (1 unrouted)
N$30  (1 unrouted)
N$31  (1 unrouted)
N$32
  Top 0.305: IC1.127 20.07,68.39 Q2.3
SPI1_MOSI  (1 unrouted)
TCK  (1 unrouted)
TDI  (1 unrouted)
TDO  (1 unrouted)
TMS  (1 unrouted)
TRST  (1 unrouted)
USB_DM
  Top 0.305: IC2.70 8.56,21.9 7.62,20.95 7.62,17.46 5.4,15.24 5.4,14.92 R12.1
USB_DP
  Top 0.305: IC2.71 9.02,21.4 8.26,20.64 8.26,17.14 6.99,15.88 R13.1
USB_ID  (1 unrouted)
USB_VBUS  (1 unrouted)
VCCINT  (1 unrouted)
  Top 0.305: 18.26,44.77 17.57,44.08 IC1.49 17.57,40.85 C13.1 | 22.86,44.77 23.57,44.06 IC1.61 23.57,40.67 C10.1 | 22.38,61.91 23.07,62.6 IC1.121 23.07,65.83 C11.1 | 17.78,61.91 17.07,62.62 IC1.133 17.07,65.75 C12.1
  Top 0.61: C29.1 C13.1 | C30.1 C10.1 | C12.1 C27.1 | C11.1 C28.1
  Bottom 0.813: IC4.3 12.93,25.95 12.38,25.4 C34.1
  pour Top (isolate 0.254): 17.14,42.55 17.14,56.52 16.83,56.83 16.83,63.5 23.5,63.5 23.5,49.53 23.81,49.21 23.81,42.55